# EAGLE schematic alltogether_8.2_4w (EAGLE 9.1.0), part 1 of 3

## Sheet 1 of 31: Power supply stage
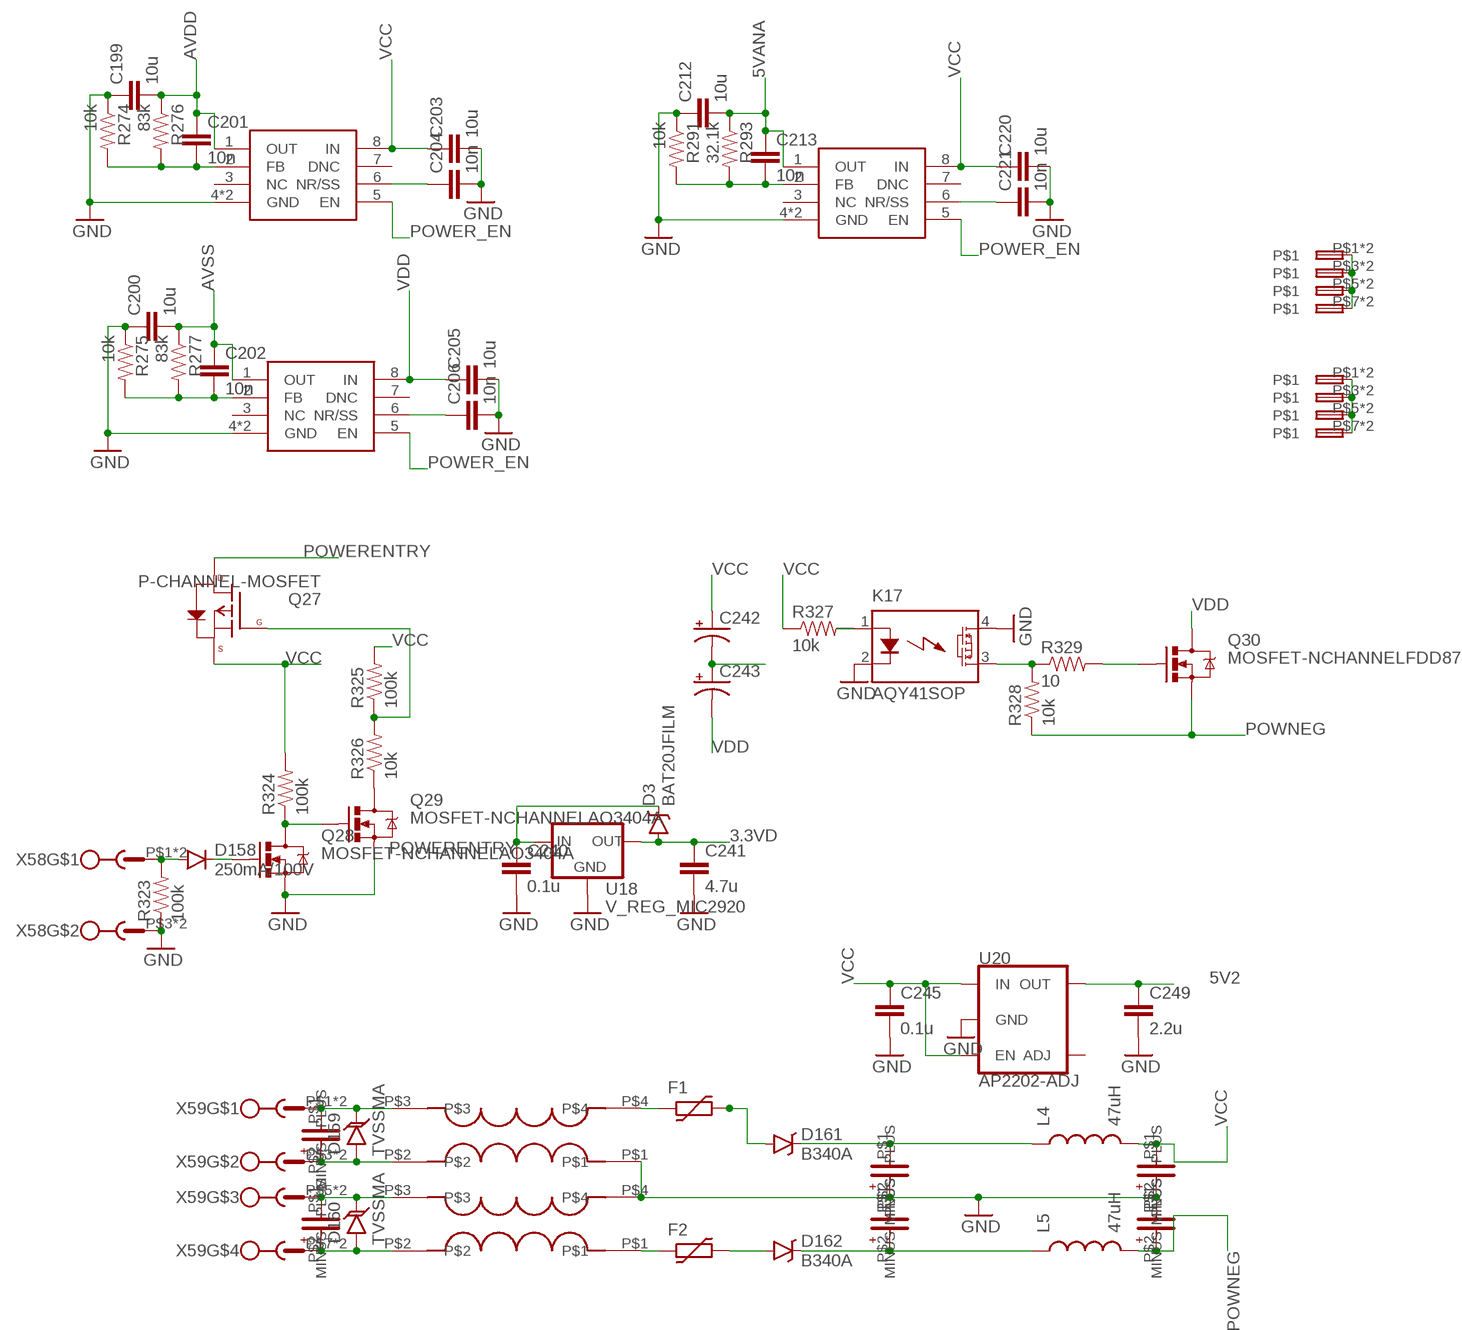
[diagram p0: schematic, sheet 1]

### Parts
C199  10u  CAP0805  [0805]
C200  10u  CAP0805  [0805]
C201  10n  CAP0402-CAP  [0402-CAP]
C202  10n  CAP0402-CAP  [0402-CAP]
C203  10u  CAP0805  [0805]
C204  10n  CAP0402-CAP  [0402-CAP]
C205  10u  CAP0805  [0805]
C206  10n  CAP0402-CAP  [0402-CAP]
C212  10u  CAP0805  [0805]
C213  10n  CAP0402-CAP  [0402-CAP]
C220  10u  CAP0805  [0805]
C221  10n  CAP0402-CAP  [0402-CAP]
C238  CAPACITOR  [LLL31]
C239  CAPACITOR  [LLL31]
C240  0.1u  CAP0402-CAP  [0402-CAP]
C241  4.7u  CAP0402-CAP  [0402-CAP]
C242  CAP_POLPTH4  [CPOL-RADIAL-1000UF-25V]
C243  CAP_POLPTH4  [CPOL-RADIAL-1000UF-25V]
C245  0.1u  CAP0402-CAP  [0402-CAP]
C246  1u  CAPACITOR  [LLL31]
C247  1u  CAPACITOR  [LLL31]
C249  2.2u  CAP0402-CAP  [0402-CAP]
C250  1u  CAPACITOR  [LLL31]
C251  1u  CAPACITOR  [LLL31]
D3  BAT20JFILM  [SOD-323]
D158  250mA/100V  DIODEBAS16  [SOD-323]
D159  TVSSMA  [SMA-DIODE]
D160  TVSSMA  [SMA-DIODE]
D161  B340A  DIODE-SCHOTTKY-B340A  [SMA-DIODE]
D162  B340A  DIODE-SCHOTTKY-B340A  [SMA-DIODE]
F1  FUSE_PTC-0805  [PTC0805]
F2  FUSE_PTC-0805  [PTC0805]
K17  AQY41SOP  [SOP04]
L2  COMMONMODEFILTER2014  [2014]
L3  COMMONMODEFILTER2014  [2014]
L4  47uH  INDUCTORCR54-47UH  [CR54]
L5  47uH  INDUCTORCR54-47UH  [CR54]
Q27  P-CHANNEL-MOSFET  [SOT23-3]
Q28  MOSFET-NCHANNELAO3404A  [SOT23-3]
Q29  MOSFET-NCHANNELAO3404A  [SOT23-3]
Q30  MOSFET-NCHANNELFDD8780  [DPAK]
R274  10k  RESISTOR0402-RES  [0402-RES]
R275  10k  RESISTOR0402-RES  [0402-RES]
R276  83k  RESISTOR0402-RES  [0402-RES]
R277  83k  RESISTOR0402-RES  [0402-RES]
R291  10k  RESISTOR0402-RES  [0402-RES]
R293  32.1k  RESISTOR0402-RES  [0402-RES]
R323  100k  RESISTOR0402-RES  [0402-RES]
R324  100k  RESISTOR0402-RES  [0402-RES]
R325  100k  RESISTOR0402-RES  [0402-RES]
R326  10k  RESISTOR0402-RES  [0402-RES]
R327  10k  RESISTOR0402-RES  [0402-RES]
R328  10k  RESISTOR0402-RES  [0402-RES]
R329  10  RESISTOR0402-RES  [0402-RES]
U7  TPS7A49  TPS7A30  [S-PDSO-G08]
U8  TPS7A30  [S-PDSO-G08]
U9  TPS7A49  TPS7A30  [S-PDSO-G08]
U18  V_REG_MIC2920  [SOT223]
U20  AP2202-ADJ  [SOT23-5]
X1  SPTAF1/4-3.5  [SPTAF1/4-3.5]
X2  SPTAF1/4-3.5  [SPTAF1/4-3.5]
X58  SPTA1.5/2  [SPTA1.5/2]
X59  SPTA1.5/4  [SPTA1.5/4]

### Nets
3.3VD: C241.1 D3.A U18.3(OUT) X2.P$1 X2.P$2 X2.P$3 X2.P$4 X2.P$5 X2.P$6 X2.P$7 X2.P$8 ; also sheet 2,3,4,5,6,11,12,13,15
5V2: C249.1 U20.5(OUT) ; also sheet 12
5VANA: C212.2 C213.1 R293.1 U9.1(OUT) ; also sheet 5
AVDD: C199.2 C201.1 R276.1 U7.1(OUT) ; also sheet 4,5,9,10
AVSS: C200.2 C202.1 R277.1 U8.1(OUT) ; also sheet 4,5,9,10
GND: C199.1 C200.1 C203.2 C204.2 C205.2 C206.2 C212.1 C220.2 C221.2 C240.2 C241.2 C242.- C243.+ C245.2 C246.P$2(PLUS) C247.P$1(MINUS) C249.2 C250.P$2(PLUS) C251.P$1(MINUS) K17.2(K) K17.4(DS1) L2.P$1 L3.P$4 Q28.2(S) Q29.2(S) R274.1 R275.1 R291.1 R323.1 U7.4(GND) U7.TH(GND) U8.4(GND) U8.TH(GND) U9.4(GND) U9.TH(GND) U18.2(GND) U20.2(GND) X1.P$1 X1.P$2 X1.P$3 X1.P$4 X1.P$5 X1.P$6 X1.P$7 X1.P$8 X58.P$3 X58.P$4 ; also sheet 2,3,4,5,6,7,8,9,10,11,12,13,15,16,17,18,19,20,21,22,23,24,25,26,27,28,29,30,31
N$28: Q28.3(D) Q29.1(G) R324.1
N$30: Q29.3(D) R326.1
N$31: Q27.1(G) R325.1 R326.2
N$34: D158.A R323.2 X58.P$1 X58.P$2
N$145: K17.3(DS2) R328.2 R329.1
N$148: Q30.1(G) R329.2
N$164: C239.P$1(MINUS) D160.C L3.P$3 X59.P$5 X59.P$6
N$183: C221.1 U9.6(NR/SS)
N$184: C213.2 R291.2 R293.2 U9.2(FB)
N$188: K17.1(A) R327.2
N$191: C238.P$1(MINUS) D159.C L2.P$3 X59.P$1 X59.P$2
N$194: C246.P$1(MINUS) D161.C L4.P$1
N$195: C238.P$2(PLUS) D159.A L2.P$2 X59.P$3 X59.P$4
N$197: C239.P$2(PLUS) D160.A L3.P$2 X59.P$7 X59.P$8
N$198: C247.P$2(PLUS) D162.C L5.P$1
N$199: F1.1 L2.P$4
N$200: F2.1 L3.P$1
N$226: C204.1 U7.6(NR/SS)
N$227: C201.2 R274.2 R276.2 U7.2(FB)
N$230: C206.1 U8.6(NR/SS)
N$231: C202.2 R275.2 R277.2 U8.2(FB)
N$241: D162.A F2.2
N$255: D161.A F1.2
POWER_EN: U7.5(EN) U8.5(EN) U9.5(EN) ; also sheet 2,3
POWERENTRY: C240.1 D3.C D158.C Q27.3(D) Q28.1(G) U18.1(IN)
POWNEG: C251.P$2(PLUS) L5.P$2 Q30.3(S) R328.1
VCC: C203.1 C220.1 C242.+ C245.1 C250.P$1(MINUS) L4.P$2 Q27.2(S) R324.2 R325.2 R327.1 U7.8(IN) U9.8(IN) U20.1(IN) U20.3(EN) ; also sheet 2,3,7,8,11,13,15,16,17,18,19,20,21,22,23,24,25,26,27,28,29,30,31
VDD: C205.1 C243.- Q30.4(D) U8.8(IN) ; also sheet 3,7,8,15,16,17,18,19,20,21,22,23,24,25,26,27,28,29,30,31
Unconnected: U7.3(NC) U7.7(DNC) U8.3(NC) U8.7(DNC) U9.3(NC) U9.7(DNC) U20.4(ADJ)

## Sheet 2 of 31: Master Digital
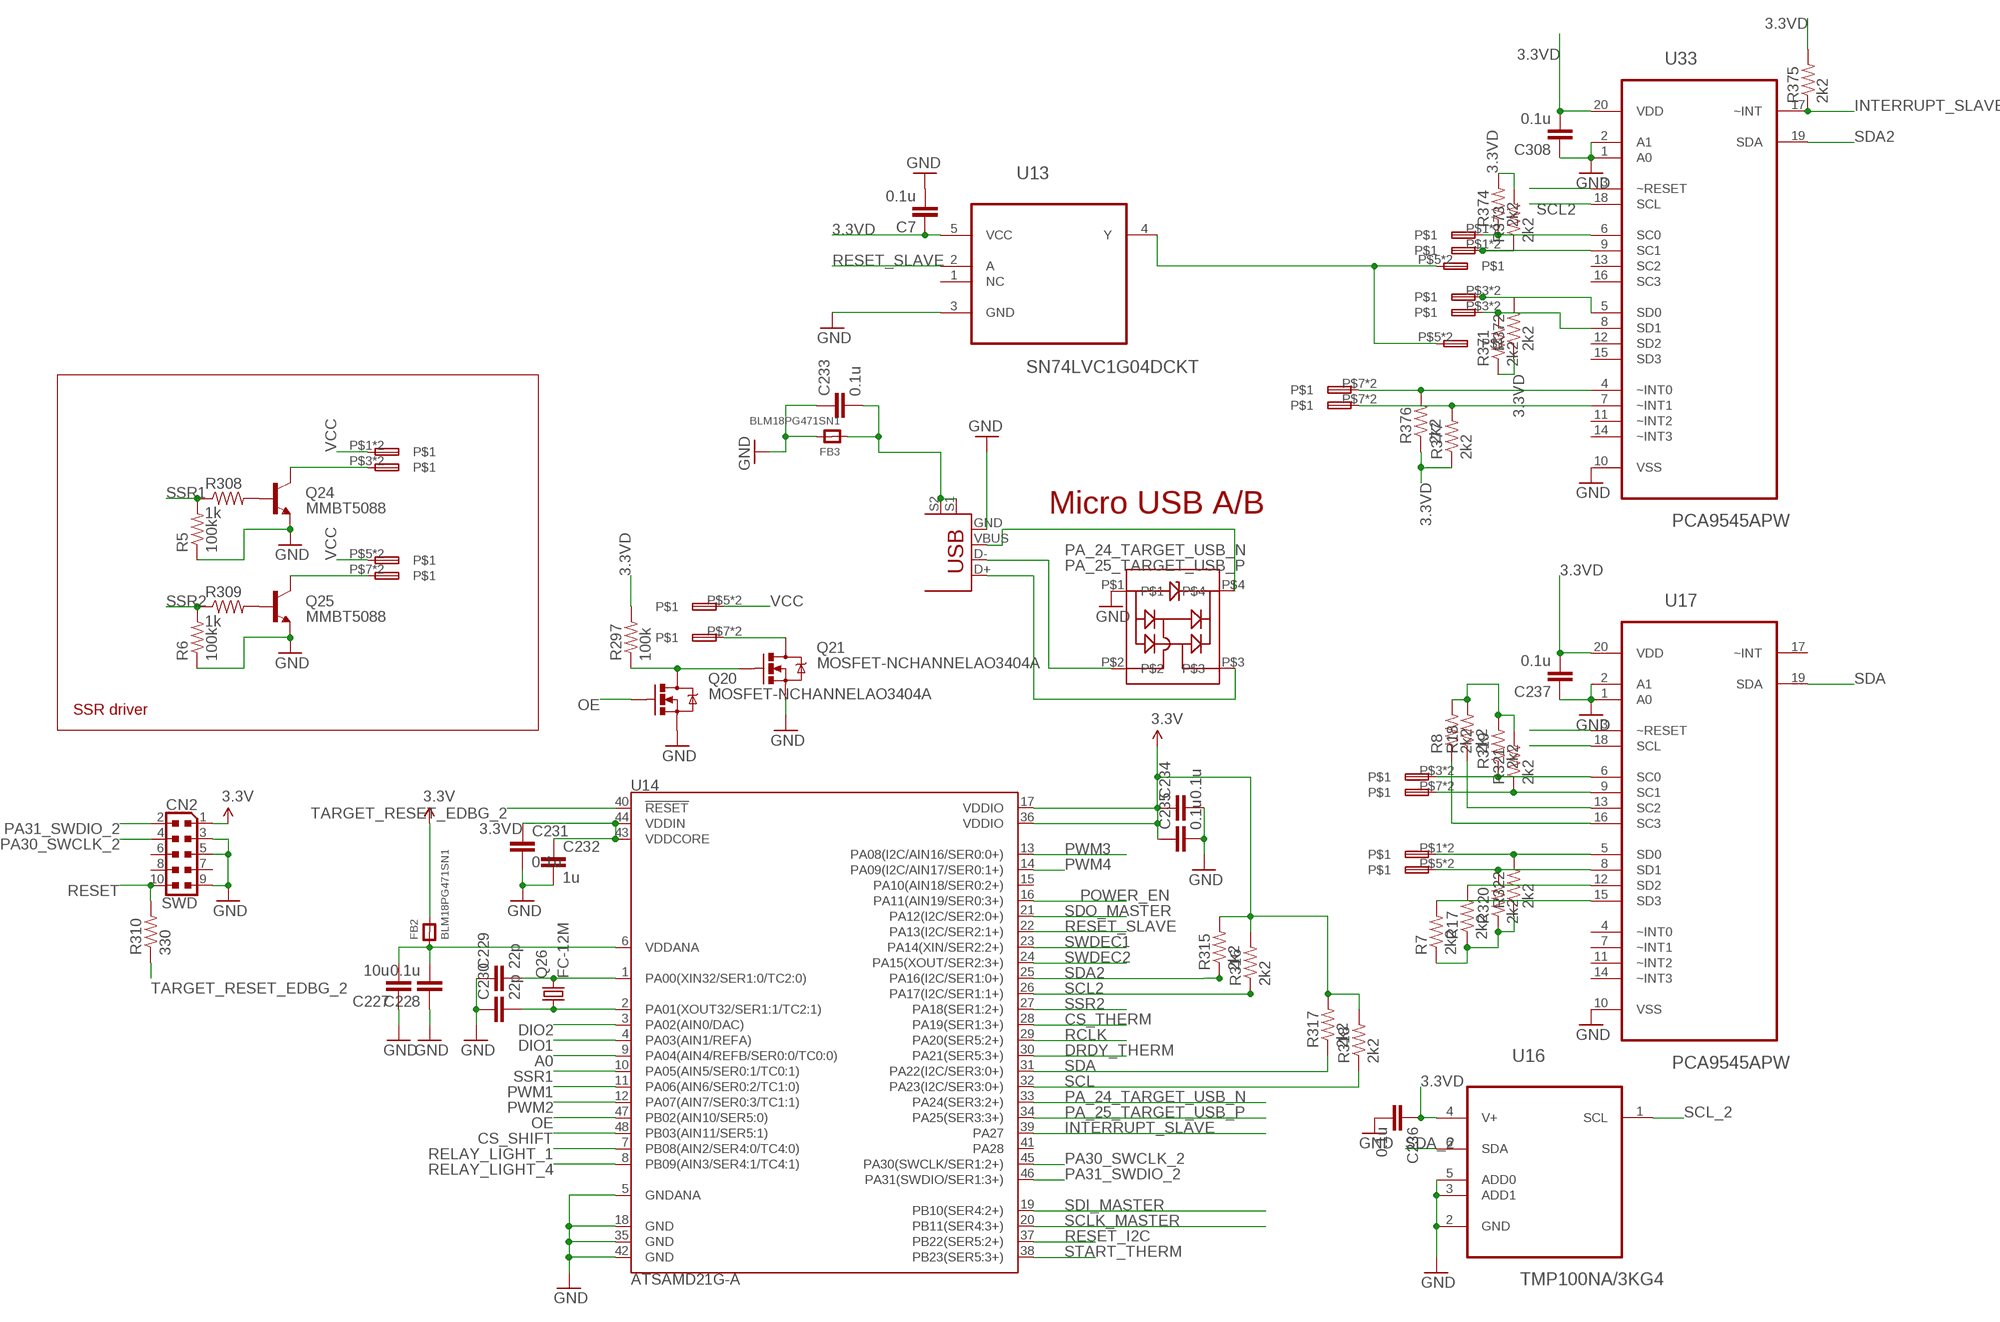
[diagram p1: schematic, sheet 2]

### Parts
C7  0.1u  CAP0402-CAP  [0402-CAP]
C227  10u  CAP0805  [0805]
C228  0.1u  CAP0402-CAP  [0402-CAP]
C229  22p  CAP0402-CAP  [0402-CAP]
C230  22p  CAP0402-CAP  [0402-CAP]
C231  0.1u  CAP0402-CAP  [0402-CAP]
C232  1u  CAP0402-CAP  [0402-CAP]
C233  0.1u  CAP0402-CAP  [0402-CAP]
C234  0.1u  CAP0402-CAP  [0402-CAP]
C235  0.1u  CAP0402-CAP  [0402-CAP]
C236  0.1u  CAP0402-CAP  [0402-CAP]
C237  0.1u  CAP0402-CAP  [0402-CAP]
C308  0.1u  CAP0402-CAP  [0402-CAP]
CN2  SWD  CONNETTORI_0171_PH127-205DF055G00A  [CONNETTORI_PINHEAD-2X5-P127]
FB2  BLM18PG471SN1  FERRITE_0603MP  [_0603MP]
FB3  BLM18PG471SN1  FERRITE_0603MP  [_0603MP]
Q20  MOSFET-NCHANNELAO3404A  [SOT23-3]
Q21  MOSFET-NCHANNELAO3404A  [SOT23-3]
Q24  MMBT5088  TRANSISTOR_NPNMMBT5088  [SOT23-3]
Q25  MMBT5088  TRANSISTOR_NPNMMBT5088  [SOT23-3]
Q26  FC-12M  [FC-12M]
R5  100k  RESISTOR0402-RES  [0402-RES]
R6  100k  RESISTOR0402-RES  [0402-RES]
R7  2k2  RESISTOR0402-RES  [0402-RES]
R8  2k2  RESISTOR0402-RES  [0402-RES]
R17  2k2  RESISTOR0402-RES  [0402-RES]
R18  2k2  RESISTOR0402-RES  [0402-RES]
R297  100k  RESISTOR0402-RES  [0402-RES]
R308  1k  RESISTOR0402-RES  [0402-RES]
R309  1k  RESISTOR0402-RES  [0402-RES]
R310  330  RESISTOR0402-RES  [0402-RES]
R315  2k2  RESISTOR0402-RES  [0402-RES]
R316  2k2  RESISTOR0402-RES  [0402-RES]
R317  2k2  RESISTOR0402-RES  [0402-RES]
R318  2k2  RESISTOR0402-RES  [0402-RES]
R319  2k2  RESISTOR0402-RES  [0402-RES]
R320  2k2  RESISTOR0402-RES  [0402-RES]
R321  2k2  RESISTOR0402-RES  [0402-RES]
R322  2k2  RESISTOR0402-RES  [0402-RES]
R371  2k2  RESISTOR0402-RES  [0402-RES]
R372  2k2  RESISTOR0402-RES  [0402-RES]
R373  2k2  RESISTOR0402-RES  [0402-RES]
R374  2k2  RESISTOR0402-RES  [0402-RES]
R375  2k2  RESISTOR0402-RES  [0402-RES]
R376  2k2  RESISTOR0402-RES  [0402-RES]
R377  2k2  RESISTOR0402-RES  [0402-RES]
U13  SN74LVC1G04DCKT  [SOT65P210X110-5N]
U14  ATSAMD21G-A  [TQFP-48]
U16  TMP100NA/3KG4  [SOT95P280X145-6N]
U17  PCA9545APW  [SOP65P640X110-20N]
U33  PCA9545APW  [SOP65P640X110-20N]
U$15  PRTR5V0U2X  [PRTR5V0U2X]
X54  SPTAF1/4-3.5  [SPTAF1/4-3.5]
X55  SPTAF1/4-3.5  [SPTAF1/4-3.5]
X56  USB+SHIELD  [USB-B-PTH]
X57  SPTAF1/4-3.5  [SPTAF1/4-3.5]
X77  SPTAF1/4-3.5  [SPTAF1/4-3.5]
X78  SPTAF1/4-3.5  [SPTAF1/4-3.5]

### Nets
3.3VD: C7.1 C231.1 C232.1 C234.1 C235.1 C236.1 C237.2 C308.2 CN2.1 FB2.2 R7.1 R8.2 R17.1 R18.2 R297.2 R315.2 R316.2 R317.2 R318.2 R319.2 R320.1 R321.2 R322.1 R371.1 R372.1 R373.2 R374.2 R375.2 R376.1 R377.1 U13.5(VCC) U14.17(VDDIO) U14.36(VDDIO) U14.43(VDDCORE) U14.44(VDDIN) U16.4(V+) U17.20(VDD) U33.20(VDD) ; supply symbol labelled 3.3V ; also sheet 1,3,4,5,6,11,12,13,15
A0: U14.9(PA04(AIN4/REFB/SER0:0/TC0:0)) ; also sheet 16,17,18,19,20,21,22,23,24,25,26,27,28,29,30,31
CS_SHIFT: U14.48(PB03(AIN11/SER5:1)) ; also sheet 6
CS_THERM: U14.28(PA19(SER1:3+)) ; also sheet 12
DIO1: U14.4(PA03(AIN1/REFA)) ; also sheet 6
DIO2: U14.3(PA02(AIN0/DAC)) ; also sheet 6
DRDY_THERM: U14.30(PA21(SER5:3+)) ; also sheet 12
GND: C7.2 C227.1 C228.1 C229.1 C230.1 C231.2 C232.2 C233.1 C234.2 C235.2 C236.2 C237.1 C308.1 CN2.3 CN2.5 CN2.9 FB3.2 Q20.2(S) Q21.2(S) Q24.2(E) Q25.2(E) R5.1 R6.1 U13.3(GND) U14.5(GNDANA) U14.18(GND) U14.35(GND) U14.42(GND) U16.2(GND) U16.3(ADD1) U16.5(ADD0) U17.1(A0) U17.2(A1) U17.10(VSS) U33.1(A0) U33.2(A1) U33.10(VSS) U$15.P$1 X56.GND ; also sheet 1,3,4,5,6,7,8,9,10,11,12,13,15,16,17,18,19,20,21,22,23,24,25,26,27,28,29,30,31
INTERRUPT_SLAVE: R375.1 U14.39(PA27) U33.17(~INT)
N$10: U13.4(Y) X77.P$5 X77.P$6 X78.P$5 X78.P$6
N$33: R374.1 U33.6(SC0) X77.P$1 X77.P$2
N$78: R373.1 U33.9(SC1) X78.P$1 X78.P$2
N$79: R372.2 U33.5(SD0) X77.P$3 X77.P$4
N$93: R371.2 U33.8(SD1) X78.P$3 X78.P$4
N$94: R377.2 U33.7(~INT1) X78.P$7 X78.P$8
N$95: R376.2 U33.4(~INT0) X77.P$7 X77.P$8
N$134: Q24.3(C) X55.P$3 X55.P$4
N$135: Q24.1(B) R308.2
N$136: Q25.1(B) R309.2
N$137: Q25.3(C) X55.P$7 X55.P$8
N$159: U$15.P$4 X56.VBUS
N$234: C229.2 Q26.2 U14.1(PA00(XIN32/SER1:0/TC2:0))
N$235: C230.2 Q26.1 U14.2(PA01(XOUT32/SER1:1/TC2:1))
N$236: C227.2 C228.2 FB2.1 U14.6(VDDANA)
N$257: Q21.3(D) X54.P$7 X54.P$8
N$313: Q20.3(D) Q21.1(G) R297.1
OE: Q20.1(G) U14.47(PB02(AIN10/SER5:0)) ; also sheet 6
PA30_SWCLK_2: CN2.4 U14.45(PA30(SWCLK/SER1:2+))
PA31_SWDIO_2: CN2.2 U14.46(PA31(SWDIO/SER1:3+))
PA_24_TARGET_USB_N: U14.33(PA24(SER3:2+)) U$15.P$2 X56.D-
PA_25_TARGET_USB_P: U14.34(PA25(SER3:3+)) U$15.P$3 X56.D+
POWER_EN: U14.16(PA11(AIN19/SER0:3+)) ; also sheet 1,3
PWM1: U14.11(PA06(AIN6/SER0:2/TC1:0)) ; also sheet 11
PWM2: U14.12(PA07(AIN7/SER0:3/TC1:1)) ; also sheet 11
PWM3: U14.13(PA08(I2C/AIN16/SER0:0+)) ; also sheet 11
PWM4: U14.14(PA09(I2C/AIN17/SER0:1+)) ; also sheet 11
RCLK: U14.29(PA20(SER5:2+)) ; also sheet 6
RELAY_LIGHT_1: U14.7(PB08(AIN2/SER4:0/TC4:0)) ; also sheet 11
RELAY_LIGHT_4: U14.8(PB09(AIN3/SER4:1/TC4:1)) ; also sheet 11
RESET: CN2.10 R310.2 ; also sheet 3,5,12
RESET_I2C: U14.37(PB22(SER5:2+)) U17.3(~RESET)
RESET_SLAVE: U13.2(A) U14.22(PA13(I2C/SER2:1+)) U33.3(~RESET)
SCL: R318.1 U14.32(PA23(I2C/SER3:0+)) U17.18(SCL) ; also sheet 3,15
SCL2: R316.1 U14.26(PA17(I2C/SER1:1+)) U33.18(SCL)
SCL_2: R18.1 U16.1(SCL) U17.13(SC2)
SCL_3: R8.1 U17.16(SC3) ; also sheet 6
SCL_LOCAL_0: R319.1 U17.6(SC0) X57.P$3 X57.P$4
SCL_LOCAL_1: R321.1 U17.9(SC1) X57.P$7 X57.P$8
SCLK_MASTER: U14.20(PB11(SER4:3+)) ; also sheet 6,12
SDA: R317.1 U14.31(PA22(I2C/SER3:0+)) U17.19(SDA) ; also sheet 3,15
SDA2: R315.1 U14.25(PA16(I2C/SER1:0+)) U33.19(SDA)
SDA_2: R17.2 U16.6(SDA) U17.12(SD2)
SDA_3: R7.2 U17.15(SD3) ; also sheet 6
SDI_MASTER: U14.19(PB10(SER4:2+)) ; also sheet 6,12
SDO_LOCAL_0: R322.2 U17.5(SD0) X57.P$1 X57.P$2
SDO_LOCAL_1: R320.2 U17.8(SD1) X57.P$5 X57.P$6
SDO_MASTER: U14.21(PA12(I2C/SER2:0+)) ; also sheet 12
SHIELD [gnd]: C233.2 FB3.1 X56.S1 X56.S2
SSR1: R5.2 R308.1 U14.10(PA05(AIN5/SER0:1/TC0:1)) ; also sheet 13
SSR2: R6.2 R309.1 U14.27(PA18(SER1:2+)) ; also sheet 13
START_THERM: U14.38(PB23(SER5:3+)) ; also sheet 12
SWDEC1: U14.23(PA14(XIN/SER2:2+)) ; also sheet 3
SWDEC2: U14.24(PA15(XOUT/SER2:3+)) ; also sheet 3
TARGET_RESET_EDBG_2: R310.1 U14.40(!RESET!)
VCC: X54.P$5 X54.P$6 X55.P$1 X55.P$2 X55.P$5 X55.P$6 ; also sheet 1,3,7,8,11,13,15,16,17,18,19,20,21,22,23,24,25,26,27,28,29,30,31
Unconnected: CN2.6 CN2.7 CN2.8 U13.1(NC) U14.15(PA10(AIN18/SER0:2+)) U14.41(PA28) U17.4(~INT0) U17.7(~INT1) U17.11(~INT2) U17.14(~INT3) U17.17(~INT) U33.11(~INT2) U33.12(SD2) U33.13(SC2) U33.14(~INT3) U33.15(SD3) U33.16(SC3)

### Notes on the sheet
- Micro USB A/B
- SSR driver

## Sheet 3 of 31: Slave digital
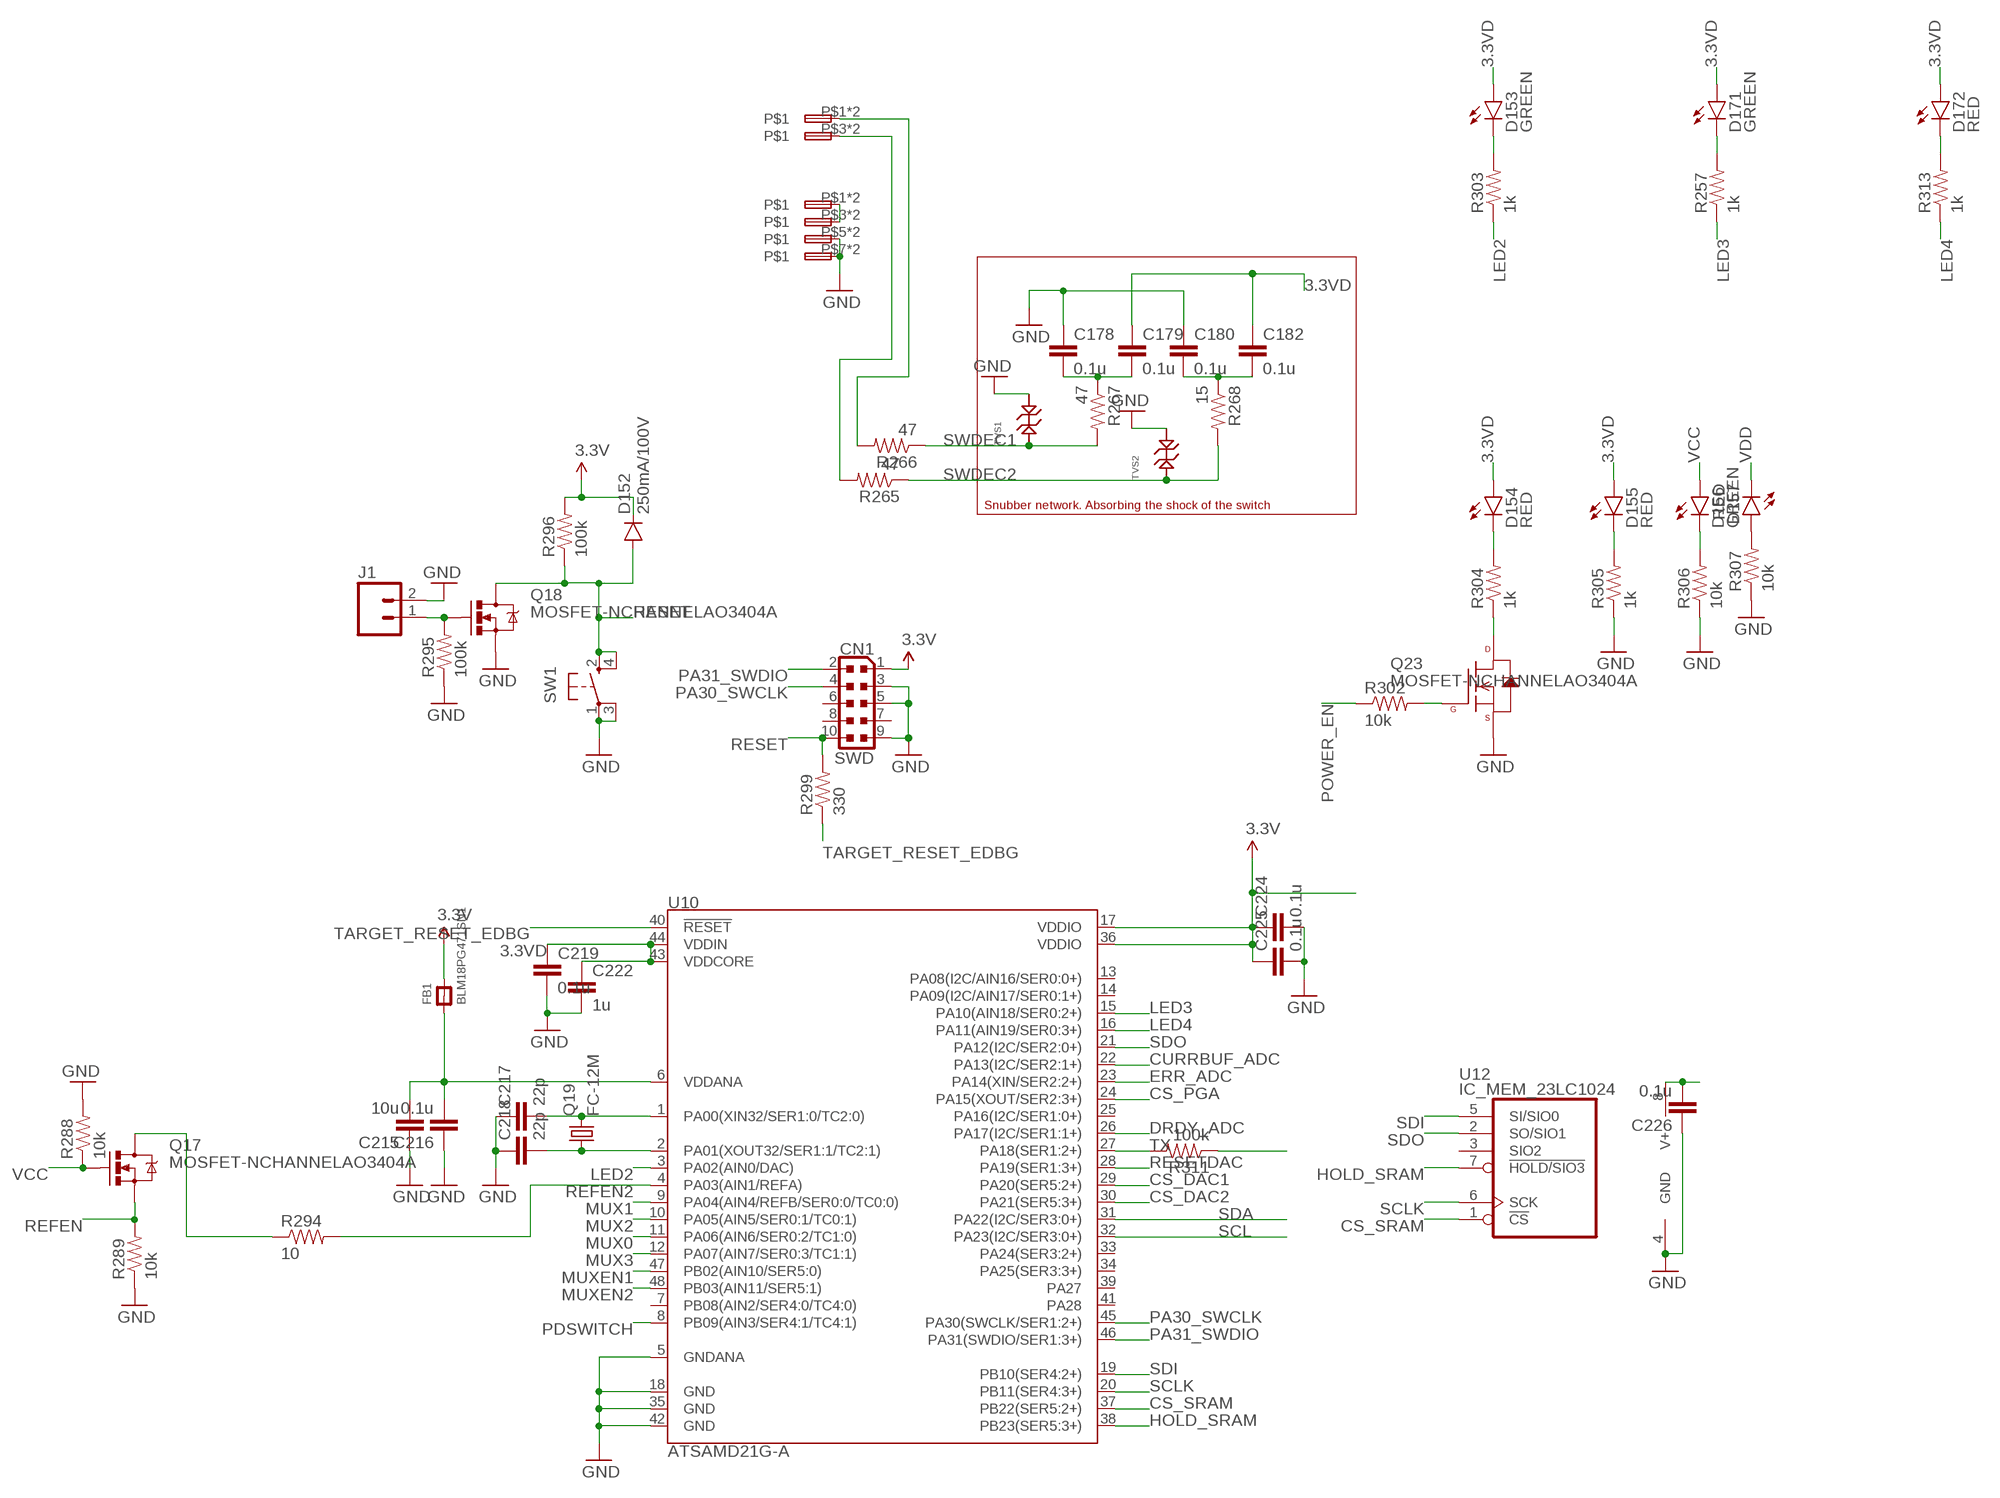
[diagram p2: schematic, sheet 3]

### Parts
C178  0.1u  CAP0402-CAP  [0402-CAP]
C179  0.1u  CAP0402-CAP  [0402-CAP]
C180  0.1u  CAP0402-CAP  [0402-CAP]
C182  0.1u  CAP0402-CAP  [0402-CAP]
C215  10u  CAP0805  [0805]
C216  0.1u  CAP0402-CAP  [0402-CAP]
C217  22p  CAP0402-CAP  [0402-CAP]
C218  22p  CAP0402-CAP  [0402-CAP]
C219  0.1u  CAP0402-CAP  [0402-CAP]
C222  1u  CAP0402-CAP  [0402-CAP]
C224  0.1u  CAP0402-CAP  [0402-CAP]
C225  0.1u  CAP0402-CAP  [0402-CAP]
C226  0.1u  CAP0402-CAP  [0402-CAP]
CN1  SWD  CONNETTORI_0171_PH127-205DF055G00A  [CONNETTORI_PINHEAD-2X5-P127]
D152  250mA/100V  DIODEBAS16  [SOD-323]
D153  GREEN  LED0603  [LED-0603]
D154  RED  LED0603  [LED-0603]
D155  RED  LED0603  [LED-0603]
D156  GREEN  LED0603  [LED-0603]
D157  RED  LED0603  [LED-0603]
D171  GREEN  LED0603  [LED-0603]
D172  RED  LED0603  [LED-0603]
FB1  BLM18PG471SN1  FERRITE_0603MP  [_0603MP]
J1  M02PTH  [1X02]
Q17  MOSFET-NCHANNELAO3404A  [SOT23-3]
Q18  MOSFET-NCHANNELAO3404A  [SOT23-3]
Q19  FC-12M  [FC-12M]
Q23  MOSFET-NCHANNELAO3404A  N-CHANNEL-MOSFET-BSS138  [SOT23-3]
R257  1k  RESISTOR0402-RES  [0402-RES]
R265  47  RESISTOR0402-RES  [0402-RES]
R266  47  RESISTOR0402-RES  [0402-RES]
R267  47  RESISTOR0402-RES  [0402-RES]
R268  15  RESISTOR0402-RES  [0402-RES]
R288  10k  RESISTOR0402-RES  [0402-RES]
R289  10k  RESISTOR0402-RES  [0402-RES]
R294  10  RESISTOR0402-RES  [0402-RES]
R295  100k  RESISTOR0402-RES  [0402-RES]
R296  100k  RESISTOR0402-RES  [0402-RES]
R299  330  RESISTOR0402-RES  [0402-RES]
R302  10k  RESISTOR0402-RES  [0402-RES]
R303  1k  RESISTOR0402-RES  [0402-RES]
R304  1k  RESISTOR0402-RES  [0402-RES]
R305  1k  RESISTOR0402-RES  [0402-RES]
R306  10k  RESISTOR0402-RES  [0402-RES]
R307  10k  RESISTOR0402-RES  [0402-RES]
R311  100k  RESISTOR0402-RES  [0402-RES]
R313  1k  RESISTOR0402-RES  [0402-RES]
SW1  SPST_TACT-KMR2  [KMR2]
TVS1  TVS_DIODE_SOD-323  [SOD-323]
TVS2  TVS_DIODE_SOD-323  [SOD-323]
U10  ATSAMD21G-A  [TQFP-48]
U12  IC_MEM_23LC1024  [SOIC-8]
X52  SPTAF1/2-3.5  [SPTAF1/2-3.5]
X53  SPTAF1/4-3.5  [SPTAF1/4-3.5]

### Nets
3.3VD: C179.1 C182.1 C219.1 C222.1 C224.1 C225.1 C226.2 CN1.1 D152.C D153.A D154.A D155.A D171.A D172.A FB1.2 R296.2 U10.17(VDDIO) U10.36(VDDIO) U10.43(VDDCORE) U10.44(VDDIN) U12.8(V+) X53.P$1 X53.P$2 X53.P$3 X53.P$4 ; supply symbol labelled 3.3V ; also sheet 1,2,4,5,6,11,12,13,15
CS_DAC1: U10.29(PA20(SER5:2+)) ; also sheet 9
CS_DAC2: U10.30(PA21(SER5:3+)) ; also sheet 10
CS_PGA: U10.24(PA15(XOUT/SER2:3+)) ; also sheet 5
CS_SRAM: U10.37(PB22(SER5:2+)) U12.1(!CS)
CURRBUF_ADC: U10.22(PA13(I2C/SER2:1+)) ; also sheet 5
DRDY_ADC: U10.26(PA17(I2C/SER1:1+)) ; also sheet 5
ERR_ADC: U10.23(PA14(XIN/SER2:2+)) ; also sheet 5
GND: C178.1 C180.1 C215.1 C216.1 C217.1 C218.1 C219.2 C222.2 C224.2 C225.2 C226.1 CN1.3 CN1.5 CN1.9 J1.2 Q18.2(S) Q23.2(S) R288.2 R289.1 R295.1 R305.1 R306.1 R307.1 SW1.1(P) SW1.3(P1) TVS1.CATH TVS2.CATH U10.5(GNDANA) U10.18(GND) U10.35(GND) U10.42(GND) U12.4(GND) X53.P$5 X53.P$6 X53.P$7 X53.P$8 ; also sheet 1,2,4,5,6,7,8,9,10,11,12,13,15,16,17,18,19,20,21,22,23,24,25,26,27,28,29,30,31
HOLD_SRAM: U10.38(PB23(SER5:3+)) U12.7(!HOLD/SIO3)
LED2: R303.1 U10.3(PA02(AIN0/DAC))
LED3: R257.1 U10.15(PA10(AIN18/SER0:2+))
LED4: R313.1 U10.16(PA11(AIN19/SER0:3+))
MOSFETDRIVE2: Q23.1(G) R302.2
MUX0: U10.11(PA06(AIN6/SER0:2/TC1:0)) ; also sheet 7,8
MUX1: U10.9(PA04(AIN4/REFB/SER0:0/TC0:0)) ; also sheet 7,8
MUX2: U10.10(PA05(AIN5/SER0:1/TC0:1)) ; also sheet 7,8
MUX3: U10.12(PA07(AIN7/SER0:3/TC1:1)) ; also sheet 7,8
MUXEN1: U10.47(PB02(AIN10/SER5:0)) ; also sheet 7
MUXEN2: U10.48(PB03(AIN11/SER5:1)) ; also sheet 8
N$96: D171.C R257.2
N$98: D172.C R313.2
N$149: C217.2 Q19.2 U10.1(PA00(XIN32/SER1:0/TC2:0))
N$150: C218.2 Q19.1 U10.2(PA01(XOUT32/SER1:1/TC2:1))
N$151: C215.2 C216.2 FB1.1 U10.6(VDDANA)
N$154: D155.C R305.2
N$155: D156.C R306.2
N$157: D154.C R304.2
N$158: Q23.3(D) R304.1
N$190: D157.A R307.2
N$225: J1.1 Q18.1(G) R295.2
N$228: D153.C R303.2
N$232: Q17.3(D) R294.1
N$250: C178.2 C179.2 R267.1
N$251: C180.2 C182.2 R268.1
PA30_SWCLK: CN1.4 U10.45(PA30(SWCLK/SER1:2+))
PA31_SWDIO: CN1.2 U10.46(PA31(SWDIO/SER1:3+))
PDSWITCH: U10.8(PB09(AIN3/SER4:1/TC4:1)) ; also sheet 4
POWER_EN: R302.1 ; also sheet 1,2
REFEN: Q17.2(S) R289.2 ; also sheet 9,10
REFEN2: R294.2 U10.4(PA03(AIN1/REFA))
RESET: CN1.10 D152.A Q18.3(D) R296.1 R299.2 SW1.2(S) SW1.4(S1) ; also sheet 2,5,12
RESETDAC: U10.28(PA19(SER1:3+)) ; also sheet 9,10
SCL: R311.1 U10.32(PA23(I2C/SER3:0+)) ; also sheet 2,15
SCLK: U10.20(PB11(SER4:3+)) U12.6(SCK) ; also sheet 5,9,10
SDA: U10.31(PA22(I2C/SER3:0+)) ; also sheet 2,15
SDI: U10.19(PB10(SER4:2+)) U12.5(SI/SIO0) ; also sheet 5,9,10
SDO: U10.21(PA12(I2C/SER2:0+)) U12.2(SO/SIO1) ; also sheet 5,9,10
SWDEC1: R266.1 R267.2 TVS1.ANODE ; also sheet 2
SWDEC1IN: R266.2 X52.P$1 X52.P$2
SWDEC2: R265.1 R268.2 TVS2.ANODE ; also sheet 2
SWDEC2IN: R265.2 X52.P$3 X52.P$4
TARGET_RESET_EDBG: R299.1 U10.40(!RESET!)
TX: R311.2 U10.27(PA18(SER1:2+))
VCC: D156.A Q17.1(G) R288.1 ; also sheet 1,2,7,8,11,13,15,16,17,18,19,20,21,22,23,24,25,26,27,28,29,30,31
VDD: D157.C ; also sheet 1,7,8,15,16,17,18,19,20,21,22,23,24,25,26,27,28,29,30,31
Unconnected: CN1.6 CN1.7 CN1.8 U10.7(PB08(AIN2/SER4:0/TC4:0)) U10.13(PA08(I2C/AIN16/SER0:0+)) U10.14(PA09(I2C/AIN17/SER0:1+)) U10.25(PA16(I2C/SER1:0+)) U10.33(PA24(SER3:2+)) U10.34(PA25(SER3:3+)) U10.39(PA27) U10.41(PA28) U12.3(SIO2)

### Notes on the sheet
- Snubber network. Absorbing the shock of the switch

## Sheet 4 of 31
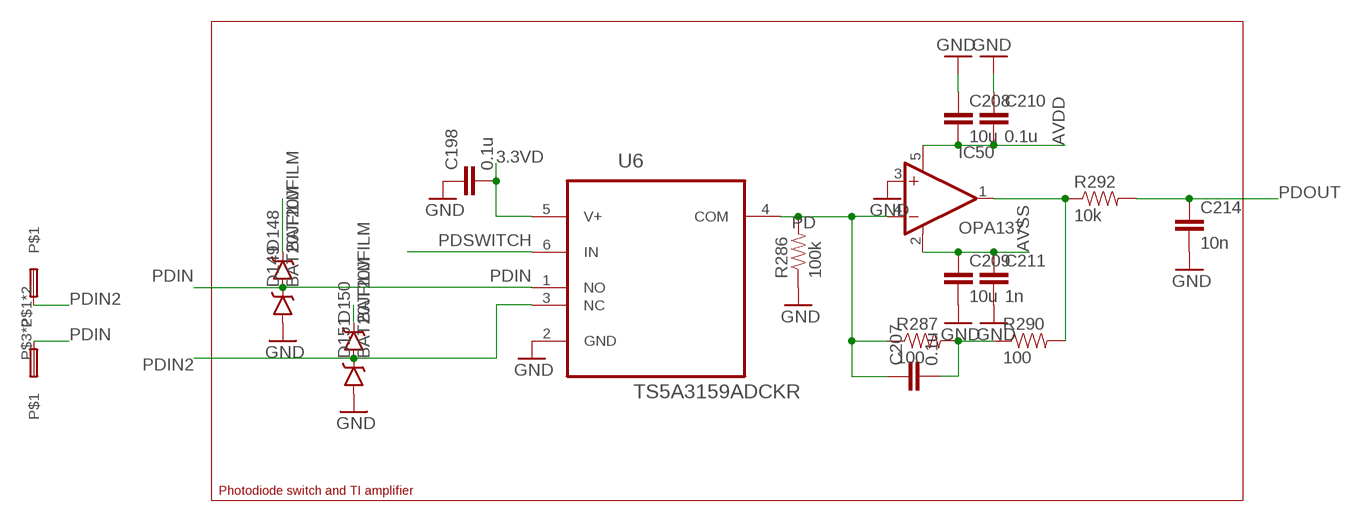
[diagram p3: schematic, sheet 4]

### Parts
C198  0.1u  CAP0402-CAP  [0402-CAP]
C207  0.1u  CAP0402-CAP  [0402-CAP]
C208  10u  CAP0805  [0805]
C209  10u  CAP0805  [0805]
C210  0.1u  CAP0402-CAP  [0402-CAP]
C211  1n  CAP0402-CAP  [0402-CAP]
C214  10n  CAP0402-CAP  [0402-CAP]
D148  BAT20JFILM  [SOD-323]
D149  BAT20JFILM  [SOD-323]
D150  BAT20JFILM  [SOD-323]
D151  BAT20JFILM  [SOD-323]
IC50  OPA137  OPA336N  [SOT23-5]
R286  100k  RESISTOR0402-RES  [0402-RES]
R287  100  RESISTOR0805-RES  [0805]
R290  100  RESISTOR0805-RES  [0805]
R292  10k  RESISTOR0402-RES  [0402-RES]
U6  TS5A3159ADCKR  [SOT65P210X110-6N]
X4  SPTAF1/2-3.5  [SPTAF1/2-3.5]

### Nets
3.3VD: C198.2 D148.C D150.C U6.5(V+) ; also sheet 1,2,3,5,6,11,12,13,15
AVDD: C208.2 C210.2 IC50.5(V+) ; also sheet 1,5,9,10
AVSS: C209.1 C211.1 IC50.2(V-) ; also sheet 1,5,9,10
GND: C198.1 C208.1 C209.2 C210.1 C211.2 C214.2 D149.A D151.A IC50.3(+IN) R286.1 U6.2(GND) ; also sheet 1,2,3,5,6,7,8,9,10,11,12,13,15,16,17,18,19,20,21,22,23,24,25,26,27,28,29,30,31
N$187: IC50.1(OUT) R290.2 R292.1
N$189: C207.2 R287.2 R290.1
PD: C207.1 IC50.4(-IN) R286.2 R287.1 U6.4(COM)
PDIN: D148.A D149.C U6.1(NO) X4.P$3 X4.P$4
PDIN2: D150.A D151.C U6.3(NC) X4.P$1 X4.P$2
PDOUT: C214.1 R292.2 ; also sheet 5
PDSWITCH: U6.6(IN) ; also sheet 3

### Notes on the sheet
- Photodiode switch and TI amplifier

## Sheet 5 of 31
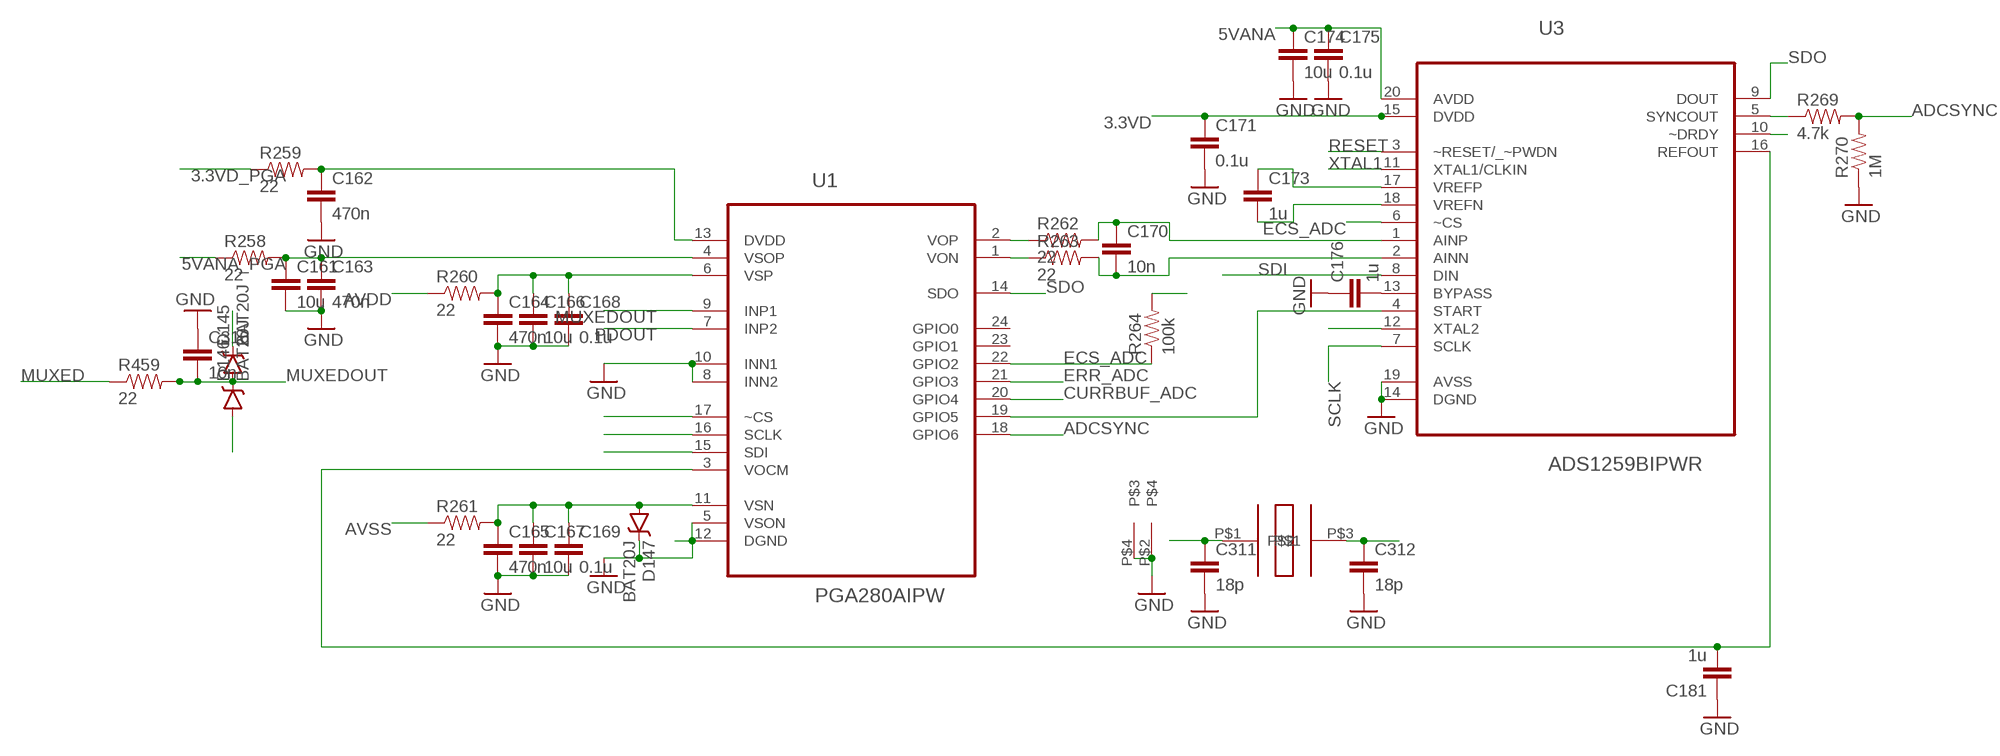
[diagram p4: schematic, sheet 5]

### Parts
C161  10u  CAP0805  [0805]
C162  470n  CAP0402-CAP  [0402-CAP]
C163  470n  CAP0402-CAP  [0402-CAP]
C164  470n  CAP0402-CAP  [0402-CAP]
C165  470n  CAP0402-CAP  [0402-CAP]
C166  10u  CAP0805  [0805]
C167  10u  CAP0805  [0805]
C168  0.1u  CAP0402-CAP  [0402-CAP]
C169  0.1u  CAP0402-CAP  [0402-CAP]
C170  10n  CAP0402-CAP  [0402-CAP]
C171  0.1u  CAP0402-CAP  [0402-CAP]
C173  1u  CAP0402-CAP  [0402-CAP]
C174  10u  CAP0805  [0805]
C175  0.1u  CAP0402-CAP  [0402-CAP]
C176  1u  CAP0402-CAP  [0402-CAP]
C181  1u  CAP0402-CAP  [0402-CAP]
C310  10n  CAP0402-CAP  [0402-CAP]
C311  18p  CAP0402-CAP  [0402-CAP]
C312  18p  CAP0402-CAP  [0402-CAP]
D145  BAT20J  DIODE-SCHOTTKY-BAT20J  [SOD-323]
D146  BAT20J  DIODE-SCHOTTKY-BAT20J  [SOD-323]
D147  BAT20J  DIODE-SCHOTTKY-BAT20J  [SOD-323]
R258  22  RESISTOR0402-RES  [0402-RES]
R259  22  RESISTOR0402-RES  [0402-RES]
R260  22  RESISTOR0402-RES  [0402-RES]
R261  22  RESISTOR0402-RES  [0402-RES]
R262  22  RESISTOR0402-RES  [0402-RES]
R263  22  RESISTOR0402-RES  [0402-RES]
R264  100k  RESISTOR0402-RES  [0402-RES]
R269  4.7k  RESISTOR0402-RES  [0402-RES]
R270  1M  RESISTOR0402-RES  [0402-RES]
R459  22  RESISTOR0402-RES  [0402-RES]
U1  PGA280AIPW  [SOP65P640X120-24N]
U3  ADS1259BIPWR  [SOP65P640X120-20N]
U$1  ABMM2  [ABMM2]

### Nets
3.3VD: C171.1 R259.1 R264.2 U3.15(DVDD) ; also sheet 1,2,3,4,6,11,12,13,15
3.3VD_PGA: C162.1 R259.2 U1.13(DVDD)
5VANA: C174.1 C175.1 R258.1 U3.20(AVDD) ; also sheet 1
5VANA_PGA: C161.1 C163.1 R258.2 U1.4(VSOP)
ADCSYNC: R269.2 R270.2 U1.18(GPIO6)
AVDD: D145.C R260.1 ; also sheet 1,4,9,10
AVSS: D146.A R261.1 ; also sheet 1,4,9,10
CS_PGA: U1.17(~CS) ; also sheet 3
CURRBUF_ADC: U1.20(GPIO4) ; also sheet 3
DRDY_ADC: U3.10(~DRDY) ; also sheet 3
ECS_ADC: R264.1 U1.22(GPIO2) U3.6(~CS)
ERR_ADC: U1.21(GPIO3) ; also sheet 3
GND: C161.2 C162.2 C163.2 C164.2 C165.2 C166.2 C167.2 C168.2 C169.2 C171.2 C174.2 C175.2 C176.1 C181.1 C310.1 C311.2 C312.2 D147.C R270.1 U1.5(VSON) U1.8(INN2) U1.10(INN1) U1.12(DGND) U3.14(DGND) U3.19(AVSS) U$1.P$2 U$1.P$4 ; also sheet 1,2,3,4,6,7,8,9,10,11,12,13,15,16,17,18,19,20,21,22,23,24,25,26,27,28,29,30,31
MUXED: R459.1 ; also sheet 7,8
MUXEDOUT: C310.2 D145.A D146.C R459.2 U1.9(INP1)
N$266: R262.1 U1.2(VOP)
N$293: R263.1 U1.1(VON)
N$294: C170.1 R262.2 U3.1(AINP)
N$295: C170.2 R263.2 U3.2(AINN)
N$297: C181.2 U1.3(VOCM) U3.16(REFOUT)
N$299: R269.1 U3.5(SYNCOUT)
N$306: U1.19(GPIO5) U3.4(START)
N$307: C164.1 C166.1 C168.1 R260.2 U1.6(VSP)
N$308: C176.2 U3.13(BYPASS)
N$309: C165.1 C167.1 C169.1 D147.A R261.2 U1.11(VSN)
N$315: C173.1 U3.17(VREFP)
N$316: C173.2 U3.18(VREFN)
PDOUT: U1.7(INP2) ; also sheet 4
RESET: U3.3(~RESET/_~PWDN) ; also sheet 2,3,12
SCLK: U1.16(SCLK) U3.7(SCLK) ; also sheet 3,9,10
SDI: U1.15(SDI) U3.8(DIN) ; also sheet 3,9,10
SDO: U1.14(SDO) U3.9(DOUT) ; also sheet 3,9,10
XTAL1: C311.1 U3.11(XTAL1/CLKIN) U$1.P$1
XTAL2: C312.1 U3.12(XTAL2) U$1.P$3
Unconnected: U1.23(GPIO1) U1.24(GPIO0)

## Sheet 6 of 31: Relay drivers
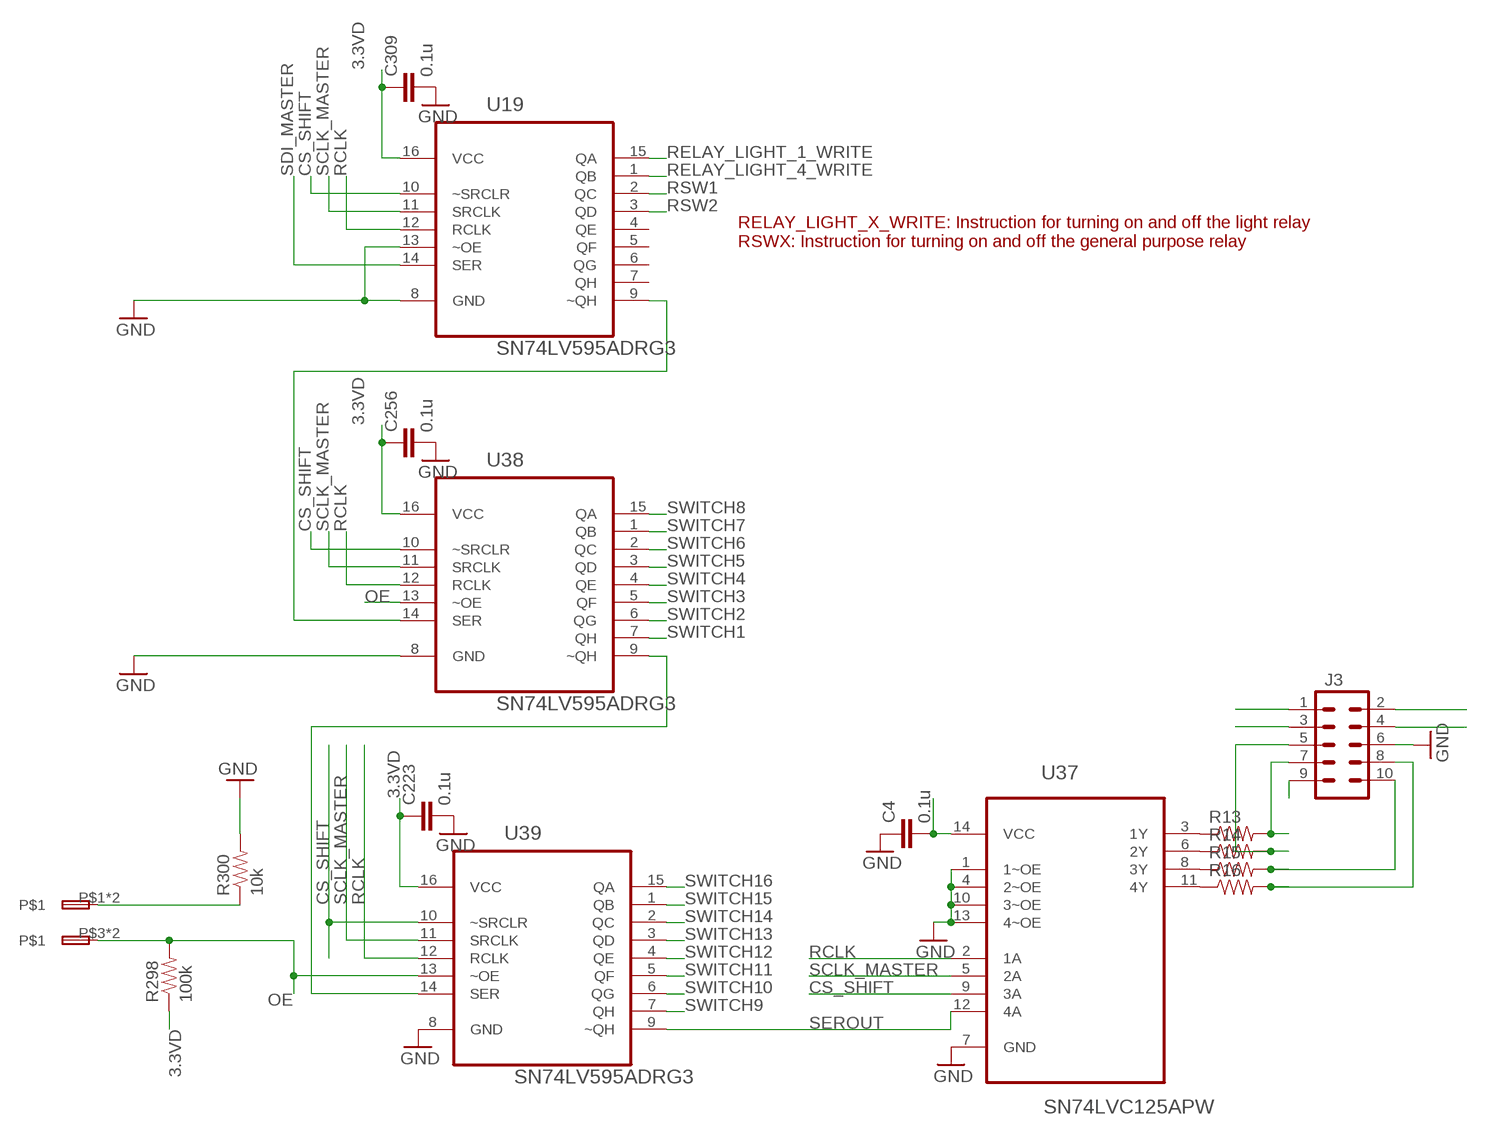
[diagram p5: schematic, sheet 6]

### Parts
C4  0.1u  CAP0402-CAP  [0402-CAP]
C223  0.1u  CAP0402-CAP  [0402-CAP]
C256  0.1u  CAP0402-CAP  [0402-CAP]
C309  0.1u  CAP0402-CAP  [0402-CAP]
J3  M05X2SHD  [2X5-SHROUDED]
R13  RESISTOR0402  [0402-RES]
R14  RESISTOR0402  [0402-RES]
R15  RESISTOR0402  [0402-RES]
R16  RESISTOR0402  [0402-RES]
R298  100k  RESISTOR0402-RES  [0402-RES]
R300  10k  RESISTOR0402-RES  [0402-RES]
U19  SN74LV595ADRG3  [SOIC127P600X175-16N]
U37  SN74LVC125APW  [SOP65P640X120-14N]
U38  SN74LV595ADRG3  [SOIC127P600X175-16N]
U39  SN74LV595ADRG3  [SOIC127P600X175-16N]

### Nets
3.3VD: C4.2 C223.1 C256.1 C309.1 J3.9 R298.1 U19.16(VCC) U37.14(VCC) U38.16(VCC) U39.16(VCC) ; also sheet 1,2,3,4,5,11,12,13,15
CS_SHIFT: U19.10(~SRCLR) U37.9(3A) U38.10(~SRCLR) U39.10(~SRCLR) ; also sheet 2
CS_SHIFT_BUFFERED: J3.10 R15.2
DIO1: J3.1 ; also sheet 2
DIO2: J3.2 ; also sheet 2
GND: C4.1 C223.2 C256.2 C309.2 J3.6 R300.2 U19.8(GND) U19.13(~OE) U37.1(1~OE) U37.4(2~OE) U37.7(GND) U37.10(3~OE) U37.13(4~OE) U38.8(GND) U39.8(GND) ; also sheet 1,2,3,4,5,7,8,9,10,11,12,13,15,16,17,18,19,20,21,22,23,24,25,26,27,28,29,30,31
N$6: R16.1 U37.11(4Y)
N$7: R15.1 U37.8(3Y)
N$8: R14.1 U37.6(2Y)
N$9: R13.1 U37.3(1Y)
N$233: R300.1 X54.P$1 X54.P$2
OE: R298.2 U38.13(~OE) U39.13(~OE) X54.P$3 X54.P$4 ; also sheet 2
RCLK: U19.12(RCLK) U37.2(1A) U38.12(RCLK) U39.12(RCLK) ; also sheet 2
RCLK_BUFFERED: J3.7 R13.2
RELAY_LIGHT_1_WRITE: U19.15(QA) ; also sheet 11
RELAY_LIGHT_4_WRITE: U19.1(QB) ; also sheet 11
RSW1: U19.2(QC) ; also sheet 13
RSW2: U19.3(QD) ; also sheet 13
SCL_3: J3.4 ; also sheet 2
SCLK_MASTER: U19.11(SRCLK) U37.5(2A) U38.11(SRCLK) U39.11(SRCLK) ; also sheet 2,12
SCLK_MASTER_BUFFERED: J3.5 R14.2
SDA_3: J3.3 ; also sheet 2
SDI_MASTER: U19.14(SER) ; also sheet 2,12
SEROUT: U37.12(4A) U39.9(~QH)
SEROUT_BUFFERED: J3.8 R16.2
SHIFT_SERIN: U38.9(~QH) U39.14(SER)
SHIFT_SERIN1: U19.9(~QH) U38.14(SER)
SWITCH1: U38.7(QH) ; also sheet 16
SWITCH2: U38.6(QG) ; also sheet 17
SWITCH3: U38.5(QF) ; also sheet 18
SWITCH4: U38.4(QE) ; also sheet 19
SWITCH5: U38.3(QD) ; also sheet 20
SWITCH6: U38.2(QC) ; also sheet 21
SWITCH7: U38.1(QB) ; also sheet 22
SWITCH8: U38.15(QA) ; also sheet 23
SWITCH9: U39.7(QH) ; also sheet 24
SWITCH10: U39.6(QG) ; also sheet 25
SWITCH11: U39.5(QF) ; also sheet 26
SWITCH12: U39.4(QE) ; also sheet 27
SWITCH13: U39.3(QD) ; also sheet 28
SWITCH14: U39.2(QC) ; also sheet 29
SWITCH15: U39.1(QB) ; also sheet 30
SWITCH16: U39.15(QA) ; also sheet 31
Unconnected: U19.4(QE) U19.5(QF) U19.6(QG) U19.7(QH)

### Notes on the sheet
- RELAY_LIGHT_X_WRITE: Instruction for turning on and off the light relay
  RSWX: Instruction for turning on and off the general purpose relay

## Sheet 7 of 31: MUX 2
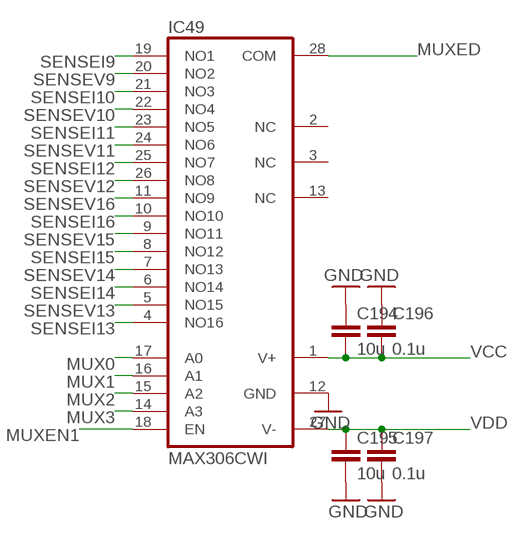
[diagram p6: schematic, sheet 7]

### Parts
C194  10u  CAP0805  [0805]
C195  10u  CAP0805  [0805]
C196  0.1u  CAP0402-CAP  [0402-CAP]
C197  0.1u  CAP0402-CAP  [0402-CAP]
IC49  MAX306CWI  [SO28L]

### Nets
GND: C194.1 C195.2 C196.1 C197.2 IC49.12(GND) ; also sheet 1,2,3,4,5,6,8,9,10,11,12,13,15,16,17,18,19,20,21,22,23,24,25,26,27,28,29,30,31
MUX0: IC49.17(A0) ; also sheet 3,8
MUX1: IC49.16(A1) ; also sheet 3,8
MUX2: IC49.15(A2) ; also sheet 3,8
MUX3: IC49.14(A3) ; also sheet 3,8
MUXED: IC49.28(COM) ; also sheet 5,8
MUXEN1: IC49.18(EN) ; also sheet 3
SENSEI9: IC49.19(NO1) ; also sheet 24
SENSEI10: IC49.21(NO3) ; also sheet 25
SENSEI11: IC49.23(NO5) ; also sheet 26
SENSEI12: IC49.25(NO7) ; also sheet 27
SENSEI13: IC49.4(NO16) ; also sheet 28
SENSEI14: IC49.6(NO14) ; also sheet 29
SENSEI15: IC49.8(NO12) ; also sheet 30
SENSEI16: IC49.10(NO10) ; also sheet 31
SENSEV9: IC49.20(NO2) ; also sheet 24
SENSEV10: IC49.22(NO4) ; also sheet 25
SENSEV11: IC49.24(NO6) ; also sheet 26
SENSEV12: IC49.26(NO8) ; also sheet 27
SENSEV13: IC49.5(NO15) ; also sheet 28
SENSEV14: IC49.7(NO13) ; also sheet 29
SENSEV15: IC49.9(NO11) ; also sheet 30
SENSEV16: IC49.11(NO9) ; also sheet 31
VCC: C194.2 C196.2 IC49.1(V+) ; also sheet 1,2,3,8,11,13,15,16,17,18,19,20,21,22,23,24,25,26,27,28,29,30,31
VDD: C195.1 C197.1 IC49.27(V-) ; also sheet 1,3,8,15,16,17,18,19,20,21,22,23,24,25,26,27,28,29,30,31
Unconnected: IC49.2(NC) IC49.3(NC) IC49.13(NC)

## Sheet 8 of 31: MUX 1
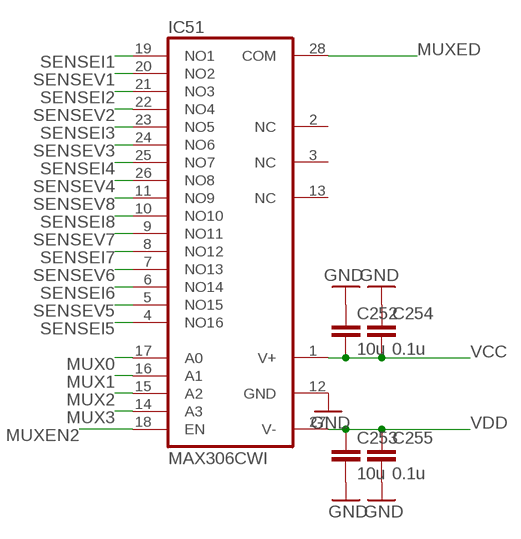
[diagram p7: schematic, sheet 8]

### Parts
C252  10u  CAP0805  [0805]
C253  10u  CAP0805  [0805]
C254  0.1u  CAP0402-CAP  [0402-CAP]
C255  0.1u  CAP0402-CAP  [0402-CAP]
IC51  MAX306CWI  [SO28L]

### Nets
GND: C252.1 C253.2 C254.1 C255.2 IC51.12(GND) ; also sheet 1,2,3,4,5,6,7,9,10,11,12,13,15,16,17,18,19,20,21,22,23,24,25,26,27,28,29,30,31
MUX0: IC51.17(A0) ; also sheet 3,7
MUX1: IC51.16(A1) ; also sheet 3,7
MUX2: IC51.15(A2) ; also sheet 3,7
MUX3: IC51.14(A3) ; also sheet 3,7
MUXED: IC51.28(COM) ; also sheet 5,7
MUXEN2: IC51.18(EN) ; also sheet 3
SENSEI1: IC51.19(NO1) ; also sheet 16
SENSEI2: IC51.21(NO3) ; also sheet 17
SENSEI3: IC51.23(NO5) ; also sheet 18
SENSEI4: IC51.25(NO7) ; also sheet 19
SENSEI5: IC51.4(NO16) ; also sheet 20
SENSEI6: IC51.6(NO14) ; also sheet 21
SENSEI7: IC51.8(NO12) ; also sheet 22
SENSEI8: IC51.10(NO10) ; also sheet 23
SENSEV1: IC51.20(NO2) ; also sheet 16
SENSEV2: IC51.22(NO4) ; also sheet 17
SENSEV3: IC51.24(NO6) ; also sheet 18
SENSEV4: IC51.26(NO8) ; also sheet 19
SENSEV5: IC51.5(NO15) ; also sheet 20
SENSEV6: IC51.7(NO13) ; also sheet 21
SENSEV7: IC51.9(NO11) ; also sheet 22
SENSEV8: IC51.11(NO9) ; also sheet 23
VCC: C252.2 C254.2 IC51.1(V+) ; also sheet 1,2,3,7,11,13,15,16,17,18,19,20,21,22,23,24,25,26,27,28,29,30,31
VDD: C253.1 C255.1 IC51.27(V-) ; also sheet 1,3,7,15,16,17,18,19,20,21,22,23,24,25,26,27,28,29,30,31
Unconnected: IC51.2(NC) IC51.3(NC) IC51.13(NC)

## Sheet 9 of 31: DAC 2
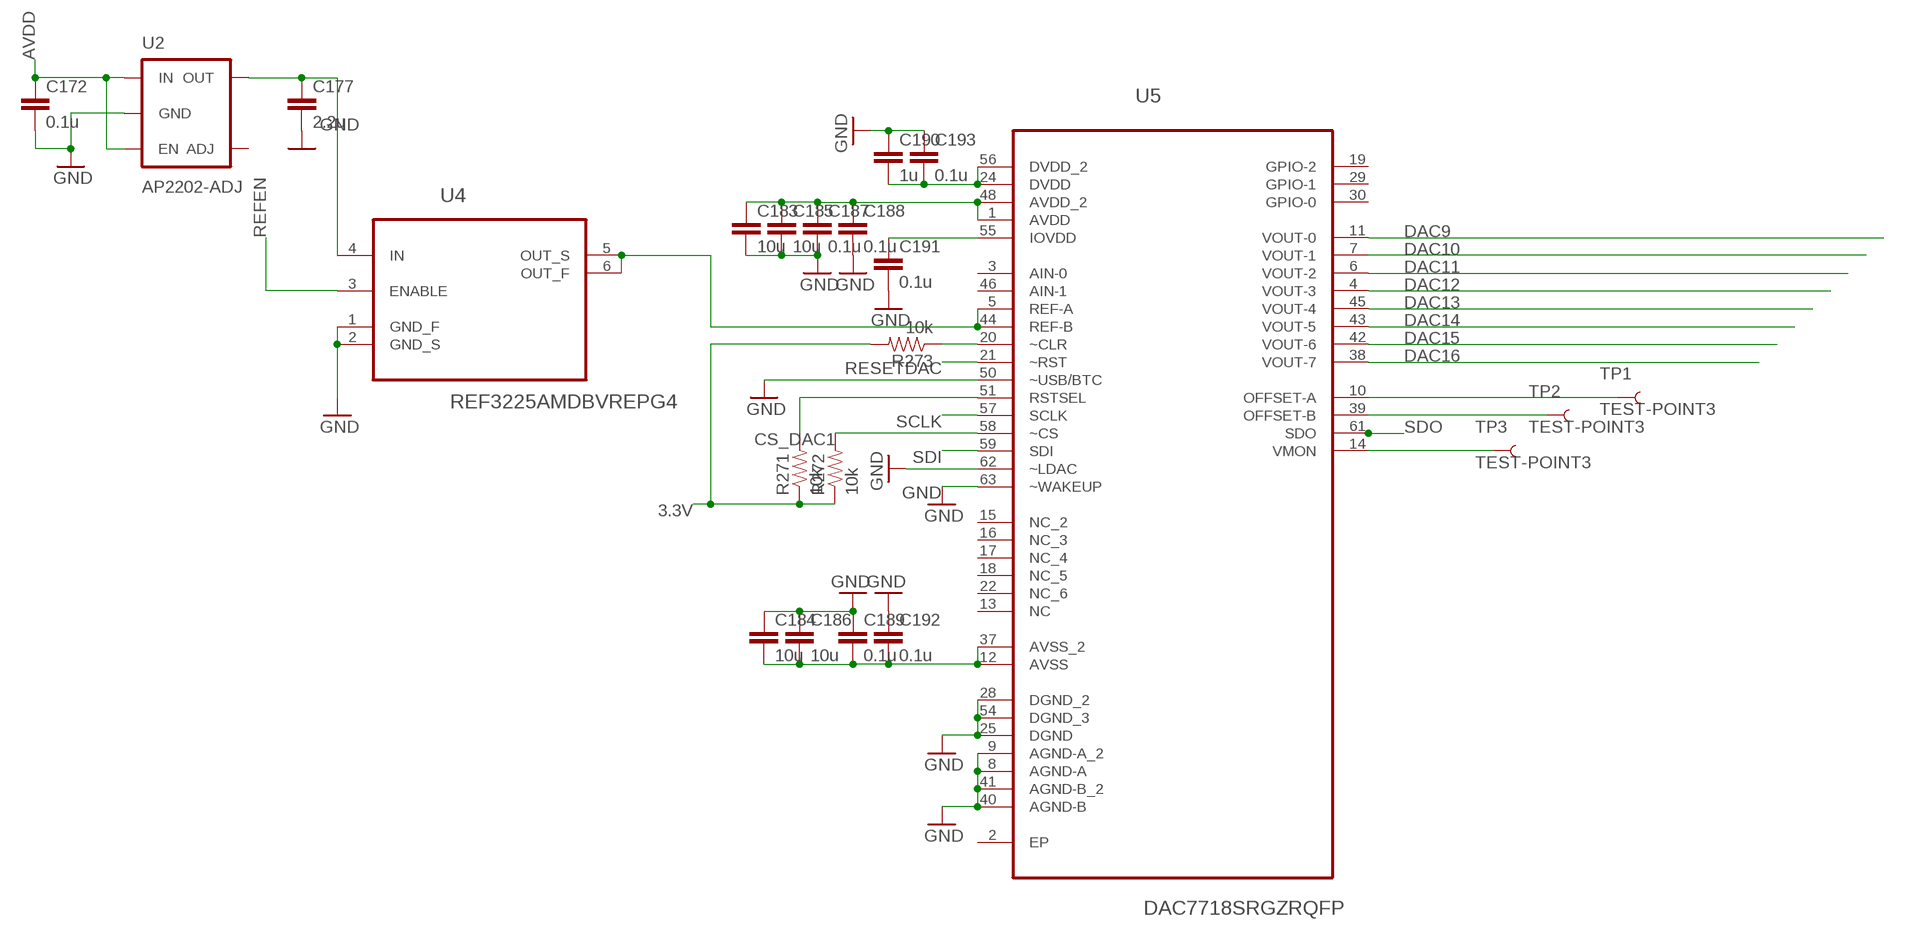
[diagram p8: schematic, sheet 9]

### Parts
C172  0.1u  CAP0402-CAP  [0402-CAP]
C177  2.2u  CAP0402-CAP  [0402-CAP]
C183  10u  CAP0805  [0805]
C184  10u  CAP0805  [0805]
C185  10u  CAP0805  [0805]
C186  10u  CAP0805  [0805]
C187  0.1u  CAP0402-CAP  [0402-CAP]
C188  0.1u  CAP0402-CAP  [0402-CAP]
C189  0.1u  CAP0402-CAP  [0402-CAP]
C190  1u  CAP0402-CAP  [0402-CAP]
C191  0.1u  CAP0402-CAP  [0402-CAP]
C192  0.1u  CAP0402-CAP  [0402-CAP]
C193  0.1u  CAP0402-CAP  [0402-CAP]
R271  10k  RESISTOR0402-RES  [0402-RES]
R272  10k  RESISTOR0402-RES  [0402-RES]
R273  10k  RESISTOR0402-RES  [0402-RES]
TP1  TEST-POINT3  [PAD.03X.03]
TP2  TEST-POINT3  [PAD.03X.03]
TP3  TEST-POINT3  [PAD.03X.03]
U2  AP2202-ADJ  [SOT23-5]
U4  REF3225AMDBVREPG4  [SOT95P280X145-6N]
U5  DAC7718SRGZRQFP  [QFP50P1200X1200X160-64N]

### Nets
3.3V: C177.1 C190.2 C191.1 C193.2 R271.1 R272.1 R273.2 U2.5(OUT) U4.4(IN) U5.24(DVDD) U5.55(IOVDD) U5.56(DVDD_2) ; also sheet 15
AVDD: C172.1 C183.1 C185.1 C187.1 C188.1 U2.1(IN) U2.3(EN) U5.1(AVDD) U5.48(AVDD_2) ; also sheet 1,4,5,10
AVSS: C184.2 C186.2 C189.2 C192.2 U5.12(AVSS) U5.37(AVSS_2) ; also sheet 1,4,5,10
CS_DAC1: R272.2 U5.58(~CS) ; also sheet 3
DAC9: U5.11(VOUT-0) ; also sheet 24
DAC10: U5.7(VOUT-1) ; also sheet 25
DAC11: U5.6(VOUT-2) ; also sheet 26
DAC12: U5.4(VOUT-3) ; also sheet 27
DAC13: U5.45(VOUT-4) ; also sheet 28
DAC14: U5.43(VOUT-5) ; also sheet 29
DAC15: U5.42(VOUT-6) ; also sheet 30
DAC16: U5.38(VOUT-7) ; also sheet 31
GND: C172.2 C177.2 C183.2 C184.1 C185.2 C186.1 C187.2 C188.2 C189.1 C190.1 C191.2 C192.1 C193.1 U2.2(GND) U4.1(GND_F) U4.2(GND_S) U5.8(AGND-A) U5.9(AGND-A_2) U5.25(DGND) U5.28(DGND_2) U5.40(AGND-B) U5.41(AGND-B_2) U5.50(~USB/BTC) U5.54(DGND_3) U5.62(~LDAC) U5.63(~WAKEUP) ; also sheet 1,2,3,4,5,6,7,8,10,11,12,13,15,16,17,18,19,20,21,22,23,24,25,26,27,28,29,30,31
N$165: TP1.P$1 U5.10(OFFSET-A)
N$166: R271.2 U5.51(RSTSEL)
N$167: R273.1 U5.20(~CLR)
N$168: TP2.P$1 U5.39(OFFSET-B)
N$169: TP3.P$1 U5.14(VMON)
N$170: U4.5(OUT_S) U4.6(OUT_F) U5.5(REF-A) U5.44(REF-B)
REFEN: U4.3(ENABLE) ; also sheet 3,10
RESETDAC: U5.21(~RST) ; also sheet 3,10
SCLK: U5.57(SCLK) ; also sheet 3,5,10
SDI: U5.59(SDI) ; also sheet 3,5,10
SDO: U5.61(SDO) ; also sheet 3,5,10
Unconnected: U2.4(ADJ) U5.2(EP) U5.3(AIN-0) U5.13(NC) U5.15(NC_2) U5.16(NC_3) U5.17(NC_4) U5.18(NC_5) U5.19(GPIO-2) U5.22(NC_6) U5.29(GPIO-1) U5.30(GPIO-0) U5.46(AIN-1)

## Sheet 10 of 31: DAC 1
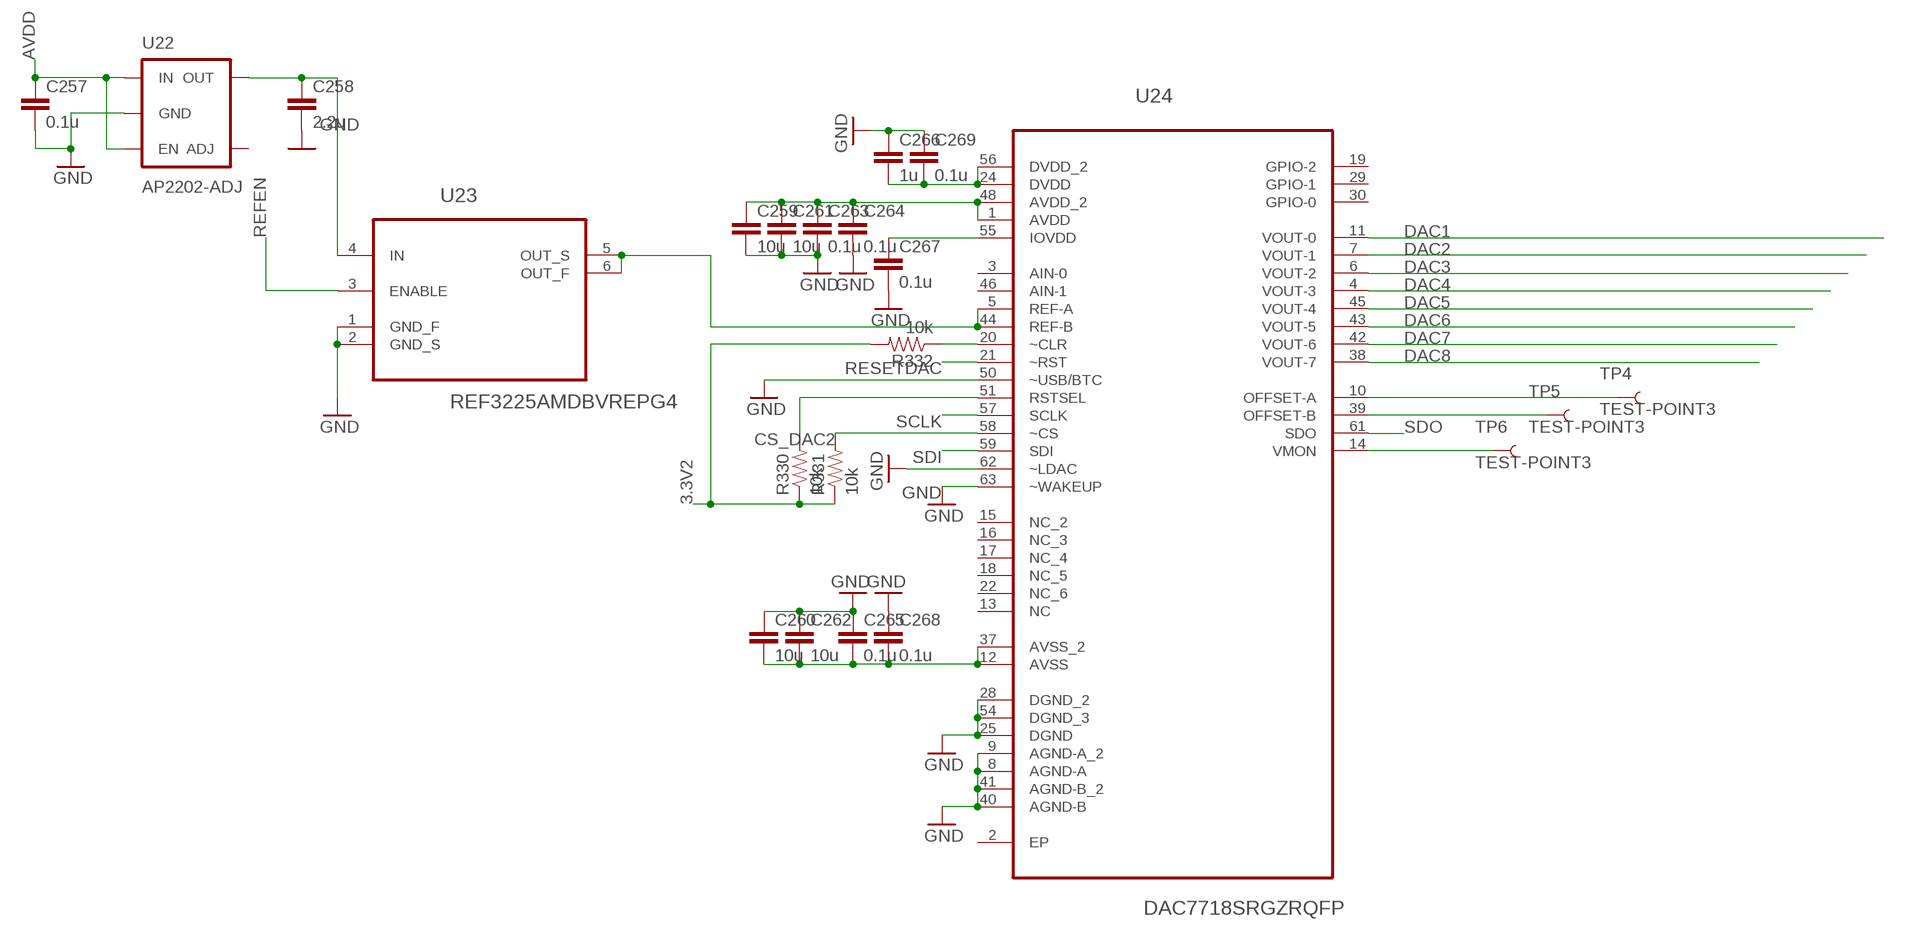
[diagram p9: schematic, sheet 10]

### Parts
C257  0.1u  CAP0402-CAP  [0402-CAP]
C258  2.2u  CAP0402-CAP  [0402-CAP]
C259  10u  CAP0805  [0805]
C260  10u  CAP0805  [0805]
C261  10u  CAP0805  [0805]
C262  10u  CAP0805  [0805]
C263  0.1u  CAP0402-CAP  [0402-CAP]
C264  0.1u  CAP0402-CAP  [0402-CAP]
C265  0.1u  CAP0402-CAP  [0402-CAP]
C266  1u  CAP0402-CAP  [0402-CAP]
C267  0.1u  CAP0402-CAP  [0402-CAP]
C268  0.1u  CAP0402-CAP  [0402-CAP]
C269  0.1u  CAP0402-CAP  [0402-CAP]
R330  10k  RESISTOR0402-RES  [0402-RES]
R331  10k  RESISTOR0402-RES  [0402-RES]
R332  10k  RESISTOR0402-RES  [0402-RES]
TP4  TEST-POINT3  [PAD.03X.03]
TP5  TEST-POINT3  [PAD.03X.03]
TP6  TEST-POINT3  [PAD.03X.03]
U22  AP2202-ADJ  [SOT23-5]
U23  REF3225AMDBVREPG4  [SOT95P280X145-6N]
U24  DAC7718SRGZRQFP  [QFP50P1200X1200X160-64N]

### Nets
3.3V2: C258.1 C266.2 C267.1 C269.2 R330.1 R331.1 R332.2 U22.5(OUT) U23.4(IN) U24.24(DVDD) U24.55(IOVDD) U24.56(DVDD_2)
AVDD: C257.1 C259.1 C261.1 C263.1 C264.1 U22.1(IN) U22.3(EN) U24.1(AVDD) U24.48(AVDD_2) ; also sheet 1,4,5,9
AVSS: C260.2 C262.2 C265.2 C268.2 U24.12(AVSS) U24.37(AVSS_2) ; also sheet 1,4,5,9
CS_DAC2: R331.2 U24.58(~CS) ; also sheet 3
DAC1: U24.11(VOUT-0) ; also sheet 16
DAC2: U24.7(VOUT-1) ; also sheet 17
DAC3: U24.6(VOUT-2) ; also sheet 18
DAC4: U24.4(VOUT-3) ; also sheet 19
DAC5: U24.45(VOUT-4) ; also sheet 20
DAC6: U24.43(VOUT-5) ; also sheet 21
DAC7: U24.42(VOUT-6) ; also sheet 22
DAC8: U24.38(VOUT-7) ; also sheet 23
GND: C257.2 C258.2 C259.2 C260.1 C261.2 C262.1 C263.2 C264.2 C265.1 C266.1 C267.2 C268.1 C269.1 U22.2(GND) U23.1(GND_F) U23.2(GND_S) U24.8(AGND-A) U24.9(AGND-A_2) U24.25(DGND) U24.28(DGND_2) U24.40(AGND-B) U24.41(AGND-B_2) U24.50(~USB/BTC) U24.54(DGND_3) U24.62(~LDAC) U24.63(~WAKEUP) ; also sheet 1,2,3,4,5,6,7,8,9,11,12,13,15,16,17,18,19,20,21,22,23,24,25,26,27,28,29,30,31
N$146: R330.2 U24.51(RSTSEL)
N$147: R332.1 U24.20(~CLR)
N$161: TP4.P$1 U24.10(OFFSET-A)
N$162: TP5.P$1 U24.39(OFFSET-B)
N$163: TP6.P$1 U24.14(VMON)
N$171: U23.5(OUT_S) U23.6(OUT_F) U24.5(REF-A) U24.44(REF-B)
REFEN: U23.3(ENABLE) ; also sheet 3,9
RESETDAC: U24.21(~RST) ; also sheet 3,9
SCLK: U24.57(SCLK) ; also sheet 3,5,9
SDI: U24.59(SDI) ; also sheet 3,5,9
SDO: U24.61(SDO) ; also sheet 3,5,9
Unconnected: U22.4(ADJ) U24.2(EP) U24.3(AIN-0) U24.13(NC) U24.15(NC_2) U24.16(NC_3) U24.17(NC_4) U24.18(NC_5) U24.19(GPIO-2) U24.22(NC_6) U24.29(GPIO-1) U24.30(GPIO-0) U24.46(AIN-1)

## Sheet 11 of 31
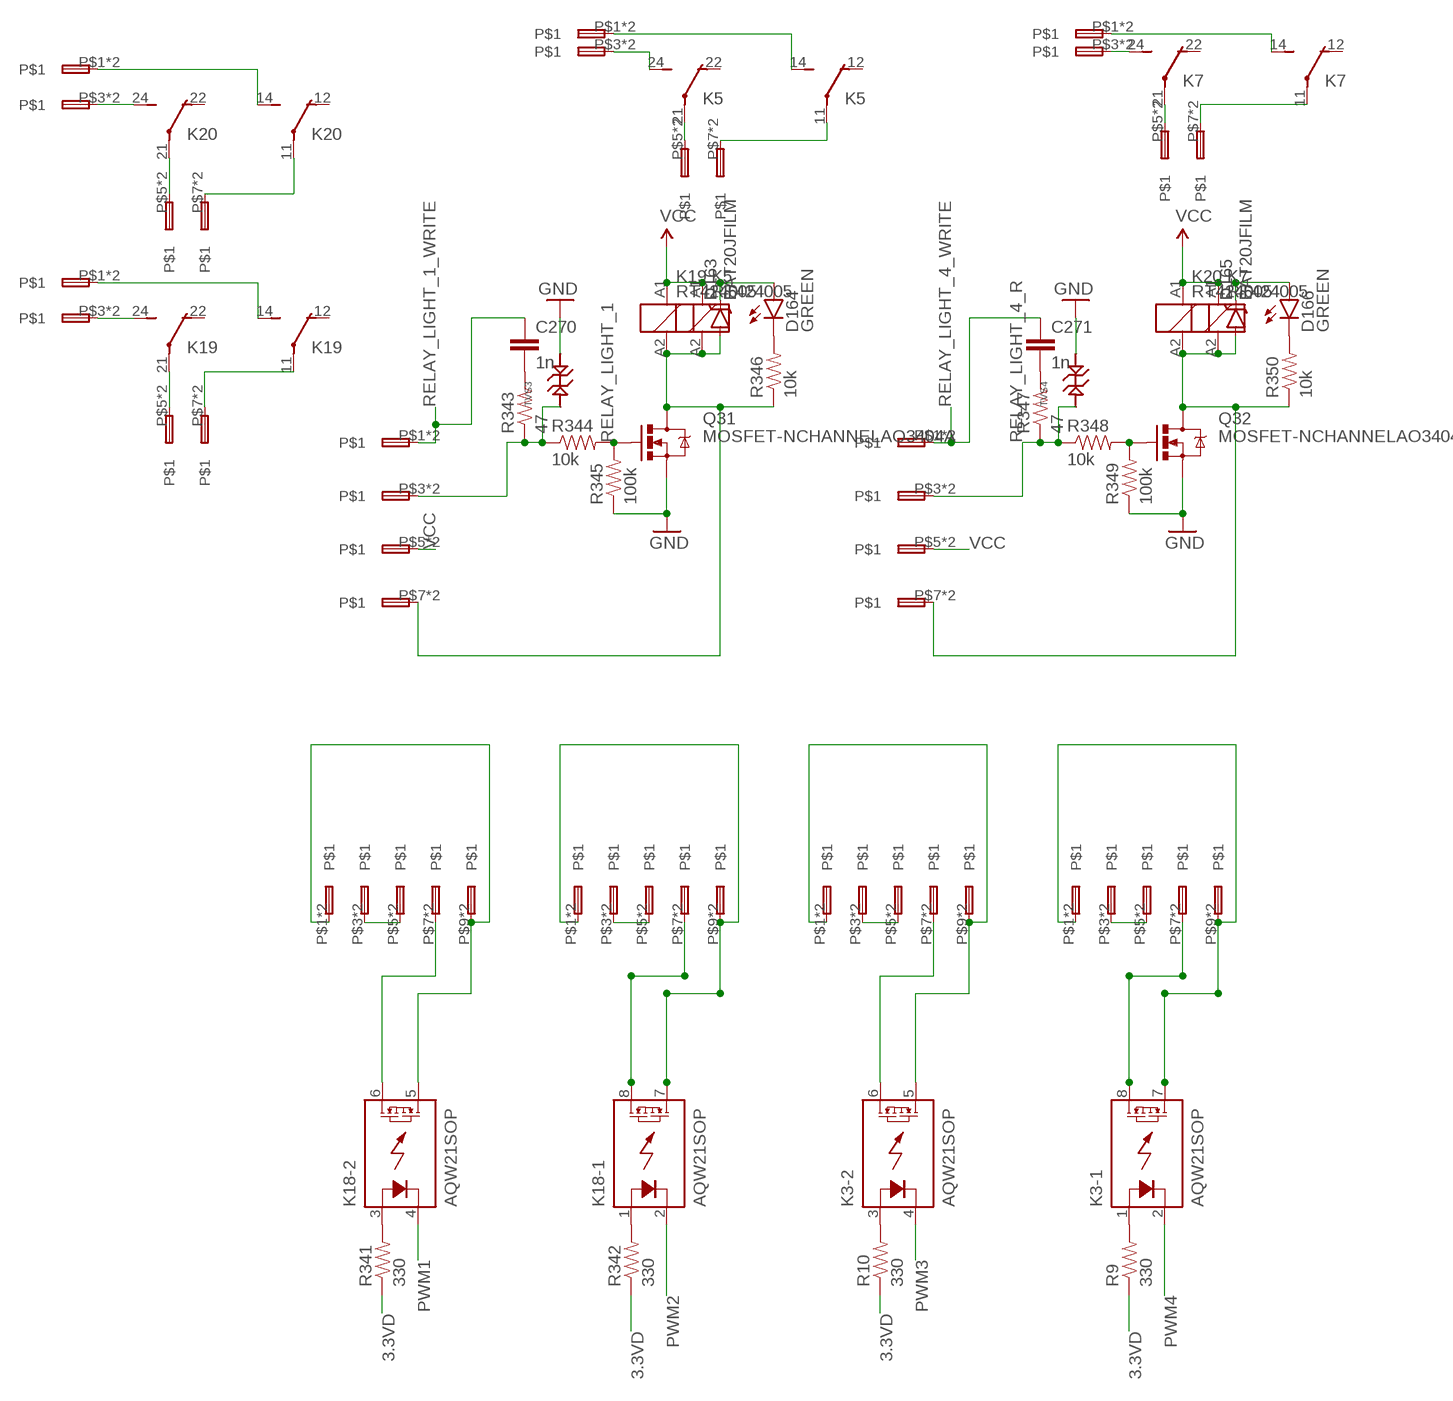
[diagram p10: schematic, sheet 11]

### Parts
C270  1n  CAP0402-CAP  [0402-CAP]
C271  1n  CAP0402-CAP  [0402-CAP]
D163  BAT20JFILM  [SOD-323]
D164  GREEN  LED0603  [LED-0603]
D165  BAT20JFILM  [SOD-323]
D166  GREEN  LED0603  [LED-0603]
K3  AQW21SOP  [SOP08]
K5  RT424005  [RT2C/O]
K7  RT424005  [RT2C/O]
K18  AQW21SOP  [SOP08]
K19  RT424005  [RT2C/O]
K20  RT424005  [RT2C/O]
Q31  MOSFET-NCHANNELAO3404A  [SOT23-3]
Q32  MOSFET-NCHANNELAO3404A  [SOT23-3]
R9  330  RESISTOR0402-RES  [0402-RES]
R10  330  RESISTOR0402-RES  [0402-RES]
R341  330  RESISTOR0402-RES  [0402-RES]
R342  330  RESISTOR0402-RES  [0402-RES]
R343  47  RESISTOR0402-RES  [0402-RES]
R344  10k  RESISTOR0402-RES  [0402-RES]
R345  100k  RESISTOR0402-RES  [0402-RES]
R346  10k  RESISTOR0402-RES  [0402-RES]
R347  47  RESISTOR0402-RES  [0402-RES]
R348  10k  RESISTOR0402-RES  [0402-RES]
R349  100k  RESISTOR0402-RES  [0402-RES]
R350  10k  RESISTOR0402-RES  [0402-RES]
TVS3  TVS_DIODE_SOD-323  [SOD-323]
TVS4  TVS_DIODE_SOD-323  [SOD-323]
X5  SPTAF1/5-3.5  [SPTAF1/5-3.5]
X6  SPTAF1/5-3.5  [SPTAF1/5-3.5]
X7  SPTAF1/4-3.5  [SPTAF1/4-3.5]
X8  SPTAF1/4-3.5  [SPTAF1/4-3.5]
X9  SPTAF1/4-3.5  [SPTAF1/4-3.5]
X10  SPTAF1/4-3.5  [SPTAF1/4-3.5]
X11  SPTAF1/5-3.5  [SPTAF1/5-3.5]
X12  SPTAF1/5-3.5  [SPTAF1/5-3.5]
X66  SPTAF1/4-3.5  [SPTAF1/4-3.5]
X67  SPTAF1/4-3.5  [SPTAF1/4-3.5]

### Nets
3.3VD: R9.1 R10.1 R341.1 R342.1 ; also sheet 1,2,3,4,5,6,12,13,15
GND: Q31.2(S) Q32.2(S) R345.1 R349.1 TVS3.CATH TVS4.CATH ; also sheet 1,2,3,4,5,6,7,8,9,10,12,13,15,16,17,18,19,20,21,22,23,24,25,26,27,28,29,30,31
N$11: K3.1(-1:A) R9.2
N$12: K3.3(-2:A) R10.2
N$13: K3.7(-1:D2) X6.P$1 X6.P$2 X6.P$9 X6.P$10
N$14: K3.8(-1:D1) X6.P$7 X6.P$8
N$15: K3.6(-2:D1) X5.P$7 X5.P$8
N$16: K3.5(-2:D2) X5.P$1 X5.P$2 X5.P$9 X5.P$10
N$17: X5.P$3 X5.P$4 X5.P$5 X5.P$6
N$18: X6.P$3 X6.P$4 X6.P$5 X6.P$6
N$19: K5.14(2:S) X9.P$1 X9.P$2
N$97: K5.11(2:P) X9.P$7 X9.P$8
N$99: K7.24(3:S) X10.P$3 X10.P$4
N$100: K7.14(2:S) X10.P$1 X10.P$2
N$101: K7.21(3:P) X10.P$5 X10.P$6
N$102: K5.21(3:P) X9.P$5 X9.P$6
N$103: K5.24(3:S) X9.P$3 X9.P$4
N$104: K7.11(2:P) X10.P$7 X10.P$8
N$243: C270.2 R343.2
N$249: C271.2 R347.2
N$258: K18.1(-1:A) R342.2
N$259: K18.3(-2:A) R341.2
N$260: K18.7(-1:D2) X12.P$1 X12.P$2 X12.P$9 X12.P$10
N$261: K18.8(-1:D1) X12.P$7 X12.P$8
N$262: K18.6(-2:D1) X11.P$7 X11.P$8
N$263: K18.5(-2:D2) X11.P$1 X11.P$2 X11.P$9 X11.P$10
N$268: K19.21(3:P) X8.P$5 X8.P$6
N$269: K19.11(2:P) X8.P$7 X8.P$8
N$270: K19.14(2:S) X8.P$1 X8.P$2
N$271: K20.21(3:P) X7.P$5 X7.P$6
N$272: K20.11(2:P) X7.P$7 X7.P$8
N$273: K20.14(2:S) X7.P$1 X7.P$2
N$274: K19.24(3:S) X8.P$3 X8.P$4
N$275: K20.24(3:S) X7.P$3 X7.P$4
N$276: X11.P$3 X11.P$4 X11.P$5 X11.P$6
N$277: X12.P$3 X12.P$4 X12.P$5 X12.P$6
N$278: D164.C R346.2
N$279: D166.C R350.2
N$280: D163.A K5.A2 K19.A2 Q31.3(D) R346.1 X66.P$7 X66.P$8
N$281: D165.A K7.A2 K20.A2 Q32.3(D) R350.1 X67.P$7 X67.P$8
PWM1: K18.4(-2:K) ; also sheet 2
PWM2: K18.2(-1:K) ; also sheet 2
PWM3: K3.4(-2:K) ; also sheet 2
PWM4: K3.2(-1:K) ; also sheet 2
RELAY_LIGHT_1: Q31.1(G) R344.2 R345.2 ; also sheet 2
RELAY_LIGHT_1_R: R343.1 R344.1 TVS3.ANODE X66.P$3 X66.P$4
RELAY_LIGHT_1_WRITE: C270.1 X66.P$1 X66.P$2 ; also sheet 6
RELAY_LIGHT_4: Q32.1(G) R348.2 R349.2 ; also sheet 2
RELAY_LIGHT_4_R: R347.1 R348.1 TVS4.ANODE X67.P$3 X67.P$4
RELAY_LIGHT_4_WRITE: C271.1 X67.P$1 X67.P$2 ; also sheet 6
VCC: D163.C D164.A D165.C D166.A K5.A1 K7.A1 K19.A1 K20.A1 X66.P$5 X66.P$6 X67.P$5 X67.P$6 ; also sheet 1,2,3,7,8,13,15,16,17,18,19,20,21,22,23,24,25,26,27,28,29,30,31
Unconnected: K5.12(2:O) K5.22(3:O) K7.12(2:O) K7.22(3:O) K19.12(2:O) K19.22(3:O) K20.12(2:O) K20.22(3:O)

## Sheet 12 of 31
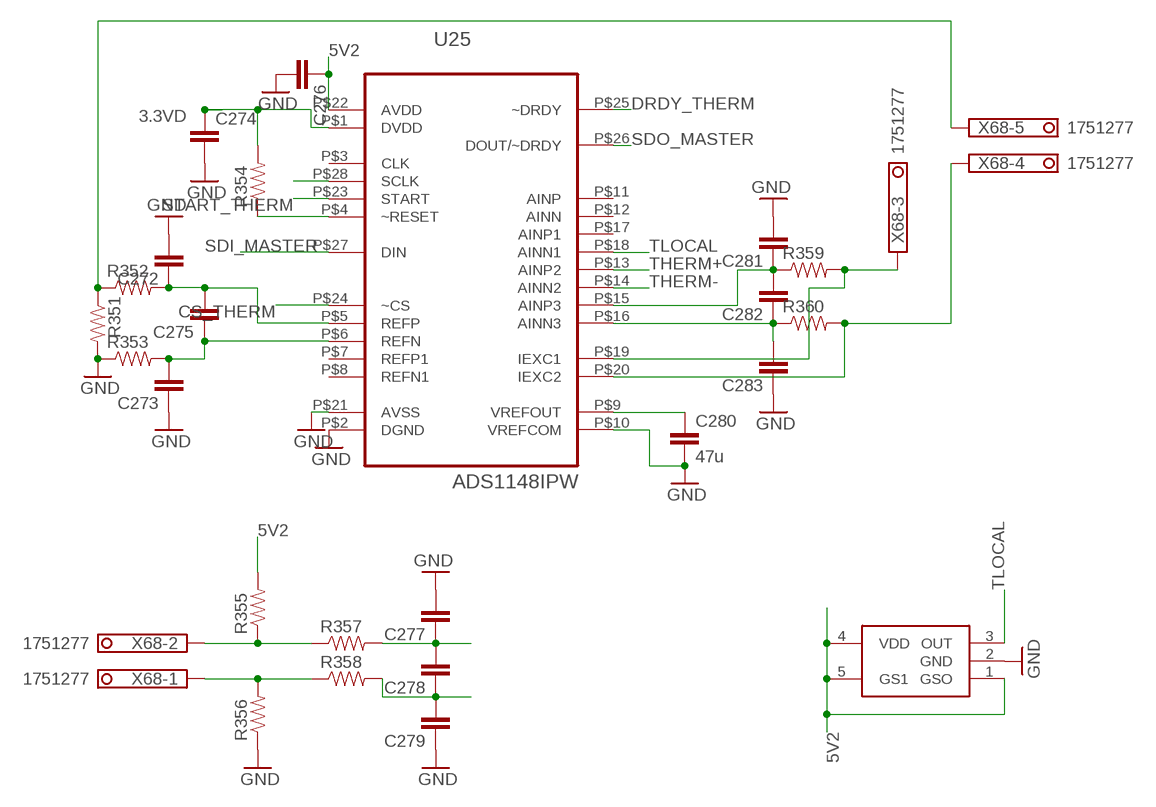
[diagram p11: schematic, sheet 12]

### Parts
C272  CAP0402-CAP  [0402-CAP]
C273  CAP0402-CAP  [0402-CAP]
C274  CAP0402-CAP  [0402-CAP]
C275  CAP0402-CAP  [0402-CAP]
C276  CAP0402-CAP  [0402-CAP]
C277  CAP0402-CAP  [0402-CAP]
C278  CAP0402-CAP  [0402-CAP]
C279  CAP0402-CAP  [0402-CAP]
C280  47u  CAP0805  [0805]
C281  CAP0402-CAP  [0402-CAP]
C282  CAP0402-CAP  [0402-CAP]
C283  CAP0402-CAP  [0402-CAP]
R351  RESISTOR0402-RES  [0402-RES]
R352  RESISTOR0402-RES  [0402-RES]
R353  RESISTOR0402-RES  [0402-RES]
R354  RESISTOR0402-RES  [0402-RES]
R355  RESISTOR0402-RES  [0402-RES]
R356  RESISTOR0402-RES  [0402-RES]
R357  RESISTOR0402-RES  [0402-RES]
R358  RESISTOR0402-RES  [0402-RES]
R359  RESISTOR0402-RES  [0402-RES]
R360  RESISTOR0402-RES  [0402-RES]
U25  ADS1148IPW  [R-PDSO-G28]
U26  LM94022  [SOT65P210X110-5N]
X68  1751277  [1751277]

### Nets
3.3VD: C274.1 R354.2 U25.P$1(DVDD) ; also sheet 1,2,3,4,5,6,11,13,15
5V2: C276.1 R355.2 U25.P$22(AVDD) U26.1(GSO) U26.4(VDD) U26.5(GS1) ; also sheet 1
CS_THERM: U25.P$24(~CS) ; also sheet 2
DRDY_THERM: U25.P$25(~DRDY) ; also sheet 2
GND: C272.2 C273.1 C274.2 C276.2 C277.2 C279.1 C280.2 C281.2 C283.1 R351.2 R353.1 R356.1 U25.P$2(DGND) U25.P$10(VREFCOM) U25.P$21(AVSS) U26.2(GND) ; also sheet 1,2,3,4,5,6,7,8,9,10,11,13,15,16,17,18,19,20,21,22,23,24,25,26,27,28,29,30,31
N$239: R355.1 R357.1 X68.2
N$264: R356.2 R358.1 X68.1
N$292: C272.1 C275.2 R352.2 U25.P$5(REFP)
N$296: C273.2 C275.1 R353.2 U25.P$6(REFN)
N$298: C280.1 U25.P$9(VREFOUT)
N$300: C282.1 C283.2 R360.1 U25.P$16(AINN3)
N$302: C281.1 C282.2 R359.1 U25.P$15(AINP3)
N$303: R351.1 R352.1 X68.5
N$304: R359.2 U25.P$19(IEXC1) X68.3
N$305: R360.2 U25.P$20(IEXC2) X68.4
RESET: R354.1 U25.P$4(~RESET) ; also sheet 2,3,5
SCLK_MASTER: U25.P$28(SCLK) ; also sheet 2,6
SDI_MASTER: U25.P$27(DIN) ; also sheet 2,6
SDO_MASTER: U25.P$26(DOUT/~DRDY) ; also sheet 2
START_THERM: U25.P$23(START) ; also sheet 2
THERM+: C277.1 C278.2 R357.2 U25.P$13(AINP2)
THERM-: C278.1 C279.2 R358.2 U25.P$14(AINN2)
TLOCAL: U25.P$18(AINN1) U26.3(OUT)
Unconnected: U25.P$3(CLK) U25.P$7(REFP1) U25.P$8(REFN1) U25.P$11(AINP) U25.P$12(AINN) U25.P$17(AINP1)

## Sheet 13 of 31: SSR
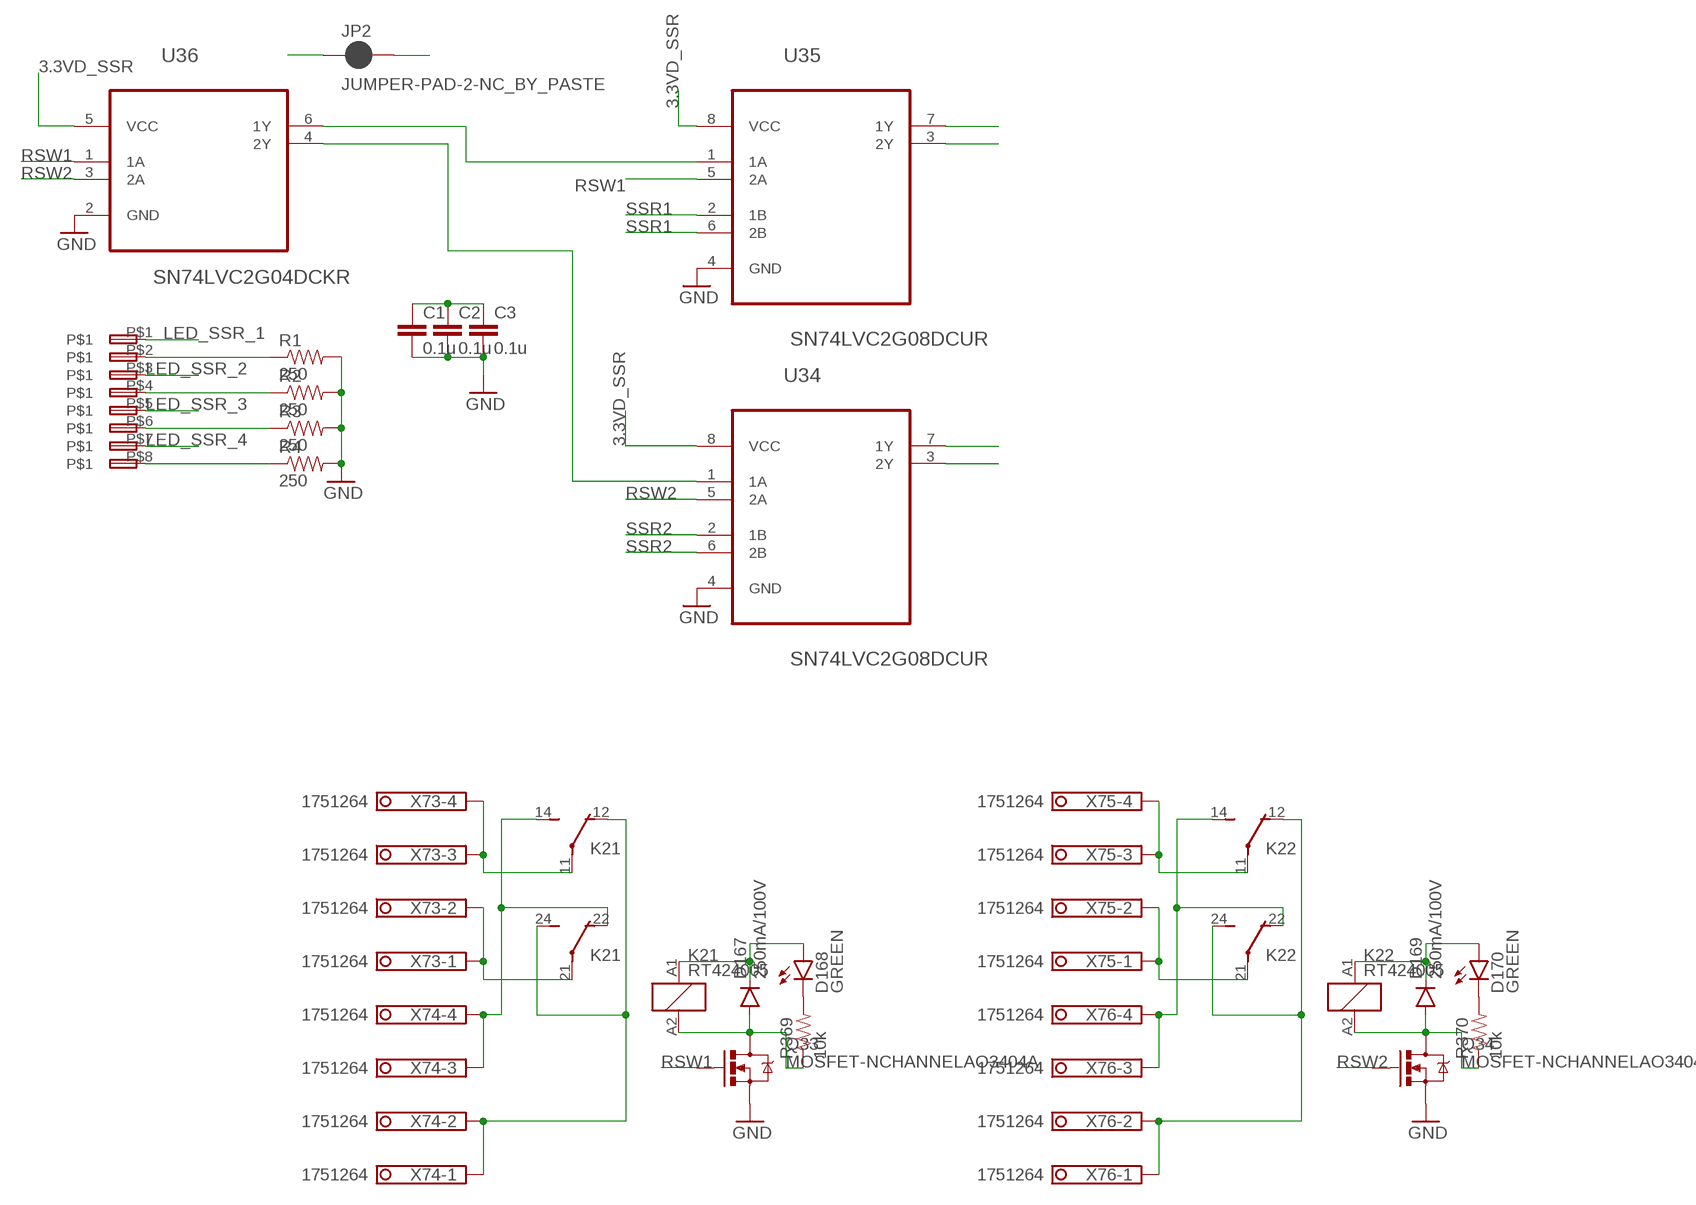
[diagram p12: schematic, sheet 13]

### Parts
C1  0.1u  CAP0402-CAP  [0402-CAP]
C2  0.1u  CAP0402-CAP  [0402-CAP]
C3  0.1u  CAP0402-CAP  [0402-CAP]
D167  250mA/100V  DIODEBAS16  [SOD-323]
D168  GREEN  LED0603  [LED-0603]
D169  250mA/100V  DIODEBAS16  [SOD-323]
D170  GREEN  LED0603  [LED-0603]
JP2  JUMPER-PAD-2-NC_BY_PASTE  [PAD-JUMPER-2-NC_BY_PASTE_YES_SILK]
K21  RT424005  [RT2C/O]
K22  RT424005  [RT2C/O]
Q33  MOSFET-NCHANNELAO3404A  [SOT23-3]
Q34  MOSFET-NCHANNELAO3404A  [SOT23-3]
R1  250  RESISTOR0402-RES  [0402-RES]
R2  250  RESISTOR0402-RES  [0402-RES]
R3  250  RESISTOR0402-RES  [0402-RES]
R4  250  RESISTOR0402-RES  [0402-RES]
R369  10k  RESISTOR0402-RES  [0402-RES]
R370  10k  RESISTOR0402-RES  [0402-RES]
U34  SN74LVC2G08DCUR  [SOP50P310X90-8N]
U35  SN74LVC2G08DCUR  [SOP50P310X90-8N]
U36  SN74LVC2G04DCKR  [SOT65P210X110-6N]
U$11  PTSA0,5/42,5  [PTSA0,5/8-2,5-Z]
X73  1751264  [1751264]
X74  1751264  [1751264]
X75  1751264  [1751264]
X76  1751264  [1751264]

### Nets
3.3VD: JP2.1 ; also sheet 1,2,3,4,5,6,11,12,15
3.3VD_SSR: C1.1 C2.1 C3.1 JP2.2 U34.8(VCC) U35.8(VCC) U36.5(VCC)
GND: C1.2 C2.2 C3.2 Q33.2(S) Q34.2(S) R1.2 R2.2 R3.2 R4.2 U34.4(GND) U35.4(GND) U36.2(GND) ; also sheet 1,2,3,4,5,6,7,8,9,10,11,12,15,16,17,18,19,20,21,22,23,24,25,26,27,28,29,30,31
LED_SSR_1: U34.3(2Y) U$11.P$1
LED_SSR_2: U34.7(1Y) U$11.P$3
LED_SSR_3: U35.3(2Y) U$11.P$5
LED_SSR_4: U35.7(1Y) U$11.P$7
N$3: U35.1(1A) U36.6(1Y)
N$4: U34.1(1A) U36.4(2Y)
N$36: K21.11(2:P) X73.3 X73.4
N$37: K21.21(3:P) X73.1 X73.2
N$38: K21.14(2:S) K21.22(3:O) X74.3 X74.4
N$39: K22.11(2:P) X75.3 X75.4
N$40: K21.12(2:O) K21.24(3:S) X74.1 X74.2
N$80: D167.A K21.A2 Q33.3(D) R369.1
N$81: D168.C R369.2
N$82: K22.21(3:P) X75.1 X75.2
N$87: K22.14(2:S) K22.22(3:O) X76.3 X76.4
N$88: K22.12(2:O) K22.24(3:S) X76.1 X76.2
N$89: D169.A K22.A2 Q34.3(D) R370.1
N$90: D170.C R370.2
N$106: R1.1 U$11.P$2
N$108: R2.1 U$11.P$4
N$110: R3.1 U$11.P$6
N$112: R4.1 U$11.P$8
RSW1: Q33.1(G) U35.5(2A) U36.1(1A) ; also sheet 6
RSW2: Q34.1(G) U34.5(2A) U36.3(2A) ; also sheet 6
SSR1: U35.2(1B) U35.6(2B) ; also sheet 2
SSR2: U34.2(1B) U34.6(2B) ; also sheet 2
VCC: D167.C D168.A D169.C D170.A K21.A1 K22.A1 ; also sheet 1,2,3,7,8,11,15,16,17,18,19,20,21,22,23,24,25,26,27,28,29,30,31

## Sheet 14 of 31
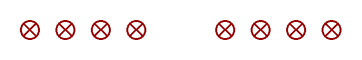
[diagram p13: schematic, sheet 14]

### Parts
U$48  FIDUCIAL  [FIDUCIAL]
U$49  FIDUCIAL  [FIDUCIAL]
U$50  FIDUCIAL  [FIDUCIAL]
U$59  FIDUCIAL  [FIDUCIAL]
U$60  FIDUCIAL  [FIDUCIAL]
U$62  FIDUCIAL  [FIDUCIAL]
U$63  FIDUCIAL  [FIDUCIAL]
U$64  FIDUCIAL  [FIDUCIAL]

## Sheet 15 of 31
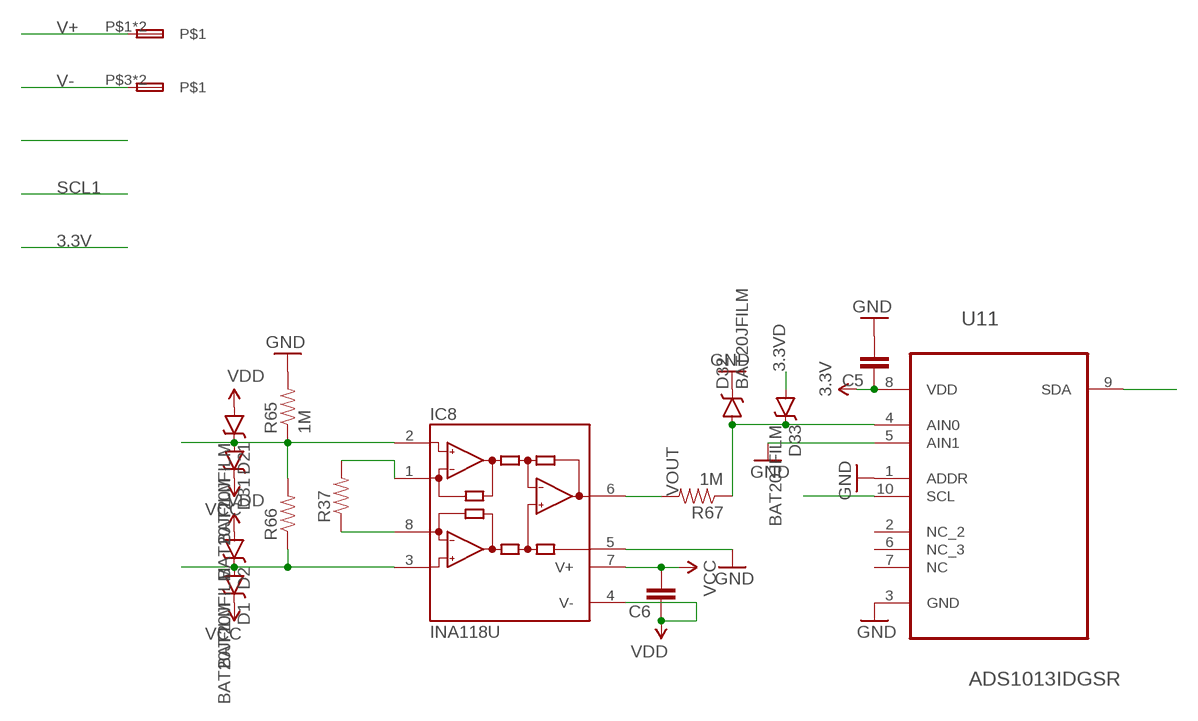
[diagram p14: schematic, sheet 15]

### Parts
C5  CAP0402-CAP  [0402-CAP]
C6  CAP0402-CAP  [0402-CAP]
D1  BAT20JFILM  [SOD-323]
D2  BAT20JFILM  [SOD-323]
D21  BAT20JFILM  [SOD-323]
D31  BAT20JFILM  [SOD-323]
D32  BAT20JFILM  [SOD-323]
D33  BAT20JFILM  [SOD-323]
IC8  INA118U  [SO08]
R37  RESISTOR0603-RES  [0603-RES]
R65  1M  RESISTOR0603-RES  [0603-RES]
R66  RESISTOR2512  [R2512]
R67  1M  RESISTOR0603-RES  [0603-RES]
U11  ADS1013IDGSR  [SOP50P490X110-10N]
X3  SPTAF1/2-3.5  [SPTAF1/2-3.5]

### Nets
3.3VD: C5.1 D33.A U11.8(VDD) ; supply symbol labelled 3.3V ; also sheet 1,2,3,4,5,6,11,12,13
GND: C5.2 D32.C IC8.5(REF) R65.2 U11.1(ADDR) U11.3(GND) U11.5(AIN1) ; also sheet 1,2,3,4,5,6,7,8,9,10,11,12,13,16,17,18,19,20,21,22,23,24,25,26,27,28,29,30,31
N$114: IC8.1(RG) R37.2
N$115: IC8.8(RG) R37.1
N$116: IC8.6(OUT) R67.2
SCL: U11.10(SCL) ; also sheet 2,3
SDA: U11.9(SDA) ; also sheet 2,3
V+: D1.A D2.C IC8.3(+IN) R66.1 X3.P$1 X3.P$2
V-: D21.C D31.A IC8.2(-IN) R65.1 R66.2 X3.P$3 X3.P$4
VCC: C6.2 D1.C D31.C IC8.7(V+) ; also sheet 1,2,3,7,8,11,13,16,17,18,19,20,21,22,23,24,25,26,27,28,29,30,31
VDD: C6.1 D2.A D21.A IC8.4(V-) ; also sheet 1,3,7,8,16,17,18,19,20,21,22,23,24,25,26,27,28,29,30,31
VOUT: D32.A D33.C R67.1 U11.4(AIN0)
Unconnected: U11.2(NC_2) U11.6(NC_3) U11.7(NC)

## Sheet 16 of 31
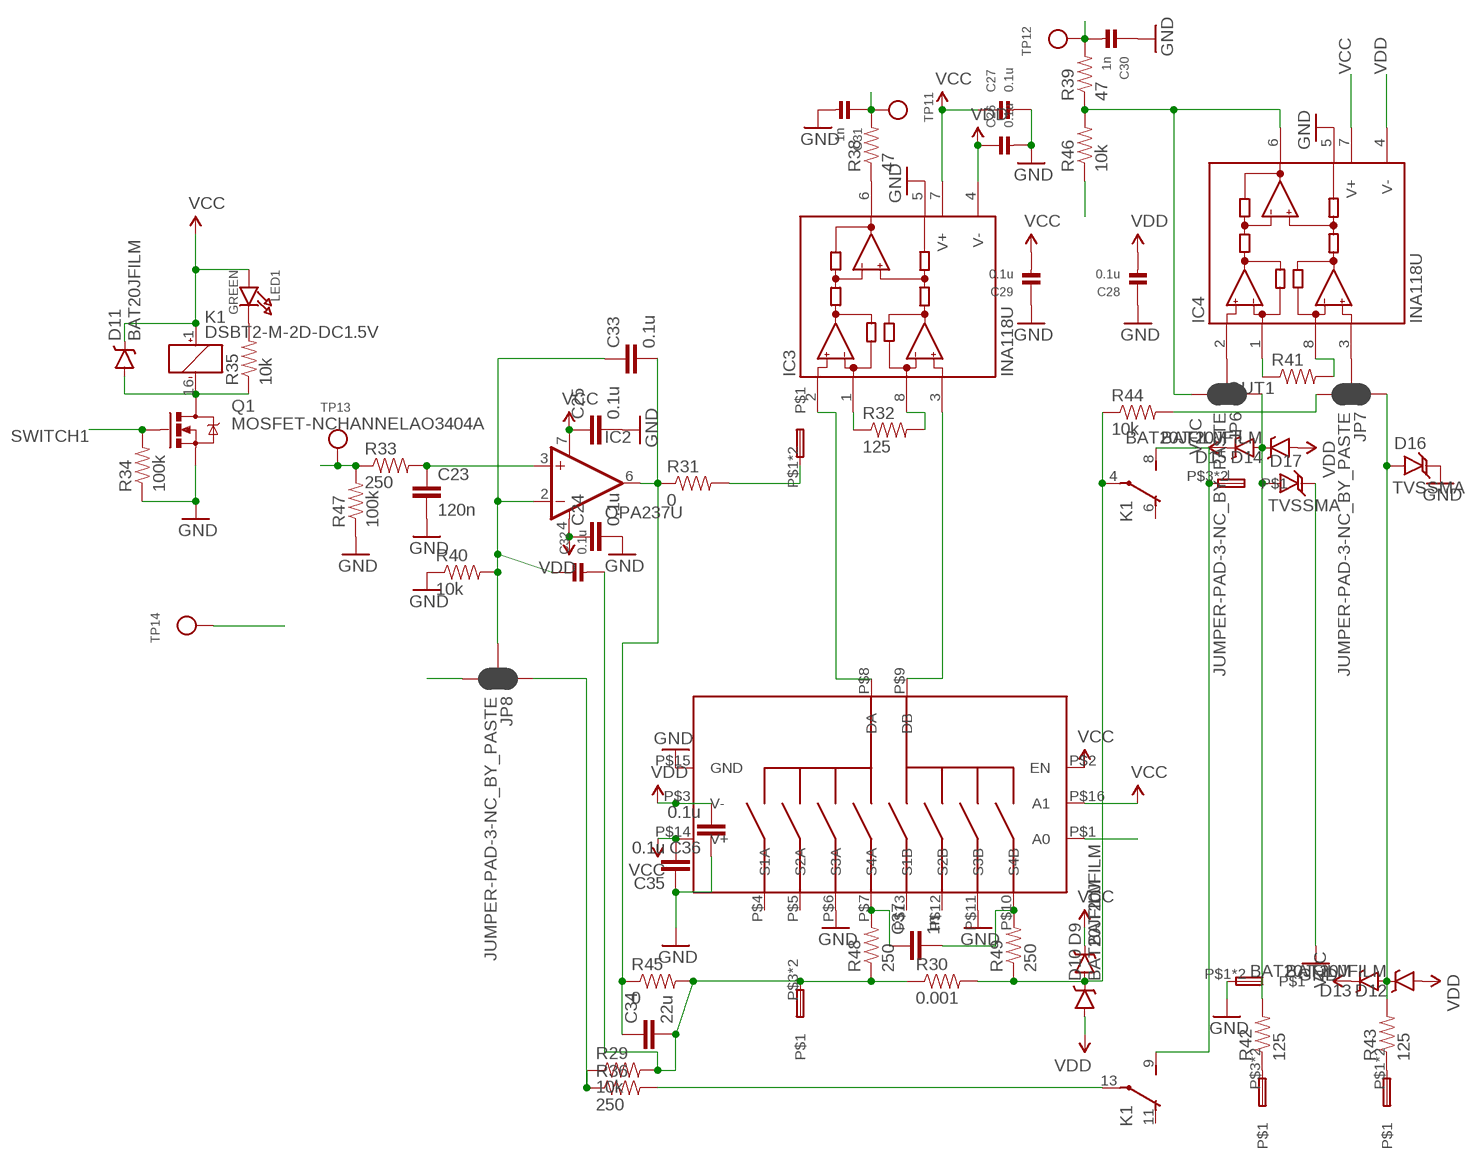
[diagram p15: schematic, sheet 16]

### Parts
C23  120n  CAP0402-CAP  [0402-CAP]
C24  0.1u  CAP0402-CAP  [0402-CAP]
C25  0.1u  CAP0402-CAP  [0402-CAP]
C26  0.1u  CAP_CERAMIC0402  [0402]
C27  0.1u  CAP_CERAMIC0402  [0402]
C28  0.1u  CAP_CERAMIC0402  [0402]
C29  0.1u  CAP_CERAMIC0402  [0402]
C30  1n  CAP_CERAMIC0402  [0402]
C31  1n  CAP_CERAMIC0402  [0402]
C32  0.1u  CAP_CERAMIC0402  [0402]
C33  0.1u  CAP0603-CAP  [0603-CAP]
C34  22u  CAP0805  [0805]
C35  0.1u  CAP0402-CAP  [0402-CAP]
C36  0.1u  CAP0402-CAP  [0402-CAP]
C37  1n  CAP0402-CAP  [0402-CAP]
D9  BAT20JFILM  [SOD-323]
D10  BAT20JFILM  [SOD-323]
D11  BAT20JFILM  [SOD-323]
D12  BAT20JFILM  [SOD-323]
D13  BAT20JFILM  [SOD-323]
D14  BAT20JFILM  [SOD-323]
D15  BAT20JFILM  [SOD-323]
D16  TVSSMA  [SMA-DIODE]
D17  TVSSMA  [SMA-DIODE]
IC2  OPA237U  [SO08]
IC3  INA118U  [SO08]
IC4  INA118U  [SO08]
JP6  JUMPER-PAD-3-NC_BY_PASTE  [PAD-JUMPER-3-NC_BY_PASTE_YES_SILK_FULL_BOX]
JP7  JUMPER-PAD-3-NC_BY_PASTE  [PAD-JUMPER-3-NC_BY_PASTE_YES_SILK_FULL_BOX]
JP8  JUMPER-PAD-3-NC_BY_PASTE  [PAD-JUMPER-3-NC_BY_PASTE_YES_SILK_FULL_BOX]
K1  DSBT2-M-2D-DC1.5V  [DS-BT]
LED1  GREEN  LED0603  [CHIPLED_0603]
Q1  MOSFET-NCHANNELAO3404A  [SOT23-3]
R29  10k  RESISTOR0402-RES  [0402-RES]
R30  0.001  0.001OHM-3W-1%(2512)3W/1%  [2512]
R31  0  RESISTOR0402-RES  [0402-RES]
R32  125  RESISTOR1206  [1206]
R33  250  RESISTOR0402-RES  [0402-RES]
R34  100k  RESISTOR0402-RES  [0402-RES]
R35  10k  RESISTOR0402-RES  [0402-RES]
R36  250  RESISTOR0402-RES  [0402-RES]
R38  47  RESISTOR0402-RES  [0402-RES]
R39  47  RESISTOR0402-RES  [0402-RES]
R40  10k  RESISTOR0402-RES  [0402-RES]
R41  RESISTOR1206  [1206]
R42  125  RESISTOR0402-RES  [0402-RES]
R43  125  RESISTOR0402-RES  [0402-RES]
R44  10k  RESISTOR0402-RES  [0402-RES]
R45  0  RESISTOR0805-RES  [0805]
R46  10k  RESISTOR0402-RES  [0402-RES]
R47  100k  RESISTOR0402-RES  [0402-RES]
R48  250  RESISTOR0402-RES  [0402-RES]
R49  250  RESISTOR0402-RES  [0402-RES]
TP11  TESTPOINT0.1"  [1X01_ROUND]
TP12  TESTPOINT0.1"  [1X01_ROUND]
TP13  TESTPOINT0.1"  [1X01_ROUND]
TP14  TESTPOINT0.1"  [1X01_ROUND]
U$5  SPTAF1/2-3.5  [SPTAF1/2-3.5]
U$6  SPTAF1/2-3.5  [SPTAF1/2-3.5]
U$7  SPTAF1/2-3.5  [SPTAF1/2-3.5]
U$8  MUX509  [R-PDSO-G16]

### Nets
A0: TP14.1 U$8.P$1(A0) ; also sheet 2,17,18,19,20,21,22,23,24,25,26,27,28,29,30,31
DAC1: R33.1 R47.2 TP13.1 ; also sheet 10
FB1: JP8.3 R46.1
GND: C23.2 C24.2 C25.2 C26.2 C27.2 C28.1 C29.1 C30.1 C31.2 C35.1 C36.1 D16.C D17.C IC3.5(REF) IC4.5(REF) Q1.2(S) R34.1 R40.1 R47.1 U$6.P$1 U$6.P$2 U$8.P$6(S3A) U$8.P$11(S3B) U$8.P$15(GND) ; also sheet 1,2,3,4,5,6,7,8,9,10,11,12,13,15,17,18,19,20,21,22,23,24,25,26,27,28,29,30,31
N$20: D9.A D10.C K1.4(2:P) R30.2 R44.1 R49.1
N$21: K1.13(3:P) R36.2
N$22: IC3.1(RG) R32.1
N$23: IC3.8(RG) R32.2
N$24: C23.1 IC2.3(+IN) R33.2
N$25: D11.A K1.16(1:-) Q1.3(D) R35.1
N$26: LED1.C R35.2
N$27: C32.1 C33.1 IC2.2(-IN) JP8.2 R40.2
N$29: C32.2 C34.2 R29.2 R30.1 R45.2 R48.1 U$5.P$3 U$5.P$4
N$32: IC3.6(OUT) R38.1
N$35: IC4.6(OUT) JP6.3 R39.1 R46.2
N$41: C33.2 C34.1 IC2.6(OUT) R31.1 R45.1
N$42: IC4.1(RG) R41.1
N$43: IC4.8(RG) R41.2
N$44: IC4.2(-IN) JP6.2
N$45: IC4.3(+IN) JP7.2
N$46: D14.C D15.A D17.A JP6.1 R42.2
N$47: R42.1 U$7.P$3 U$7.P$4
N$48: D12.C D13.A D16.A JP7.1 R43.2
N$49: R43.1 U$7.P$1 U$7.P$2
N$50: JP7.3 R44.2
N$51: JP8.1 R29.1 R36.1
N$52: R31.2 U$5.P$1 U$5.P$2
N$53: IC3.2(-IN) U$8.P$8(DA)
N$54: IC3.3(+IN) U$8.P$9(DB)
N$55: C37.2 R49.2 U$8.P$10(S4B)
N$56: C37.1 R48.2 U$8.P$7(S4A)
OUT1: K1.8(2:S) K1.9(3:S) U$6.P$3 U$6.P$4
SENSEI1: C31.1 R38.2 TP11.1 ; also sheet 8
SENSEV1: C30.2 R39.2 TP12.1 ; also sheet 8
SWITCH1: Q1.1(G) R34.2 ; also sheet 6
VCC: C25.1 C27.1 C29.2 C35.2 D9.C D11.C D13.C D15.C IC2.7(V+) IC3.7(V+) IC4.7(V+) K1.1(1:+) LED1.A U$8.P$2(EN) U$8.P$14(V+) U$8.P$16(A1) ; also sheet 1,2,3,7,8,11,13,15,17,18,19,20,21,22,23,24,25,26,27,28,29,30,31
VDD: C24.1 C26.1 C28.2 C36.2 D10.A D12.A D14.A IC2.4(V-) IC3.4(V-) IC4.4(V-) U$8.P$3(V-) ; also sheet 1,3,7,8,15,17,18,19,20,21,22,23,24,25,26,27,28,29,30,31
Unconnected: K1.6(2:O) K1.11(3:O) U$8.P$4(S1A) U$8.P$5(S2A) U$8.P$12(S2B) U$8.P$13(S1B)

## Sheet 17 of 31
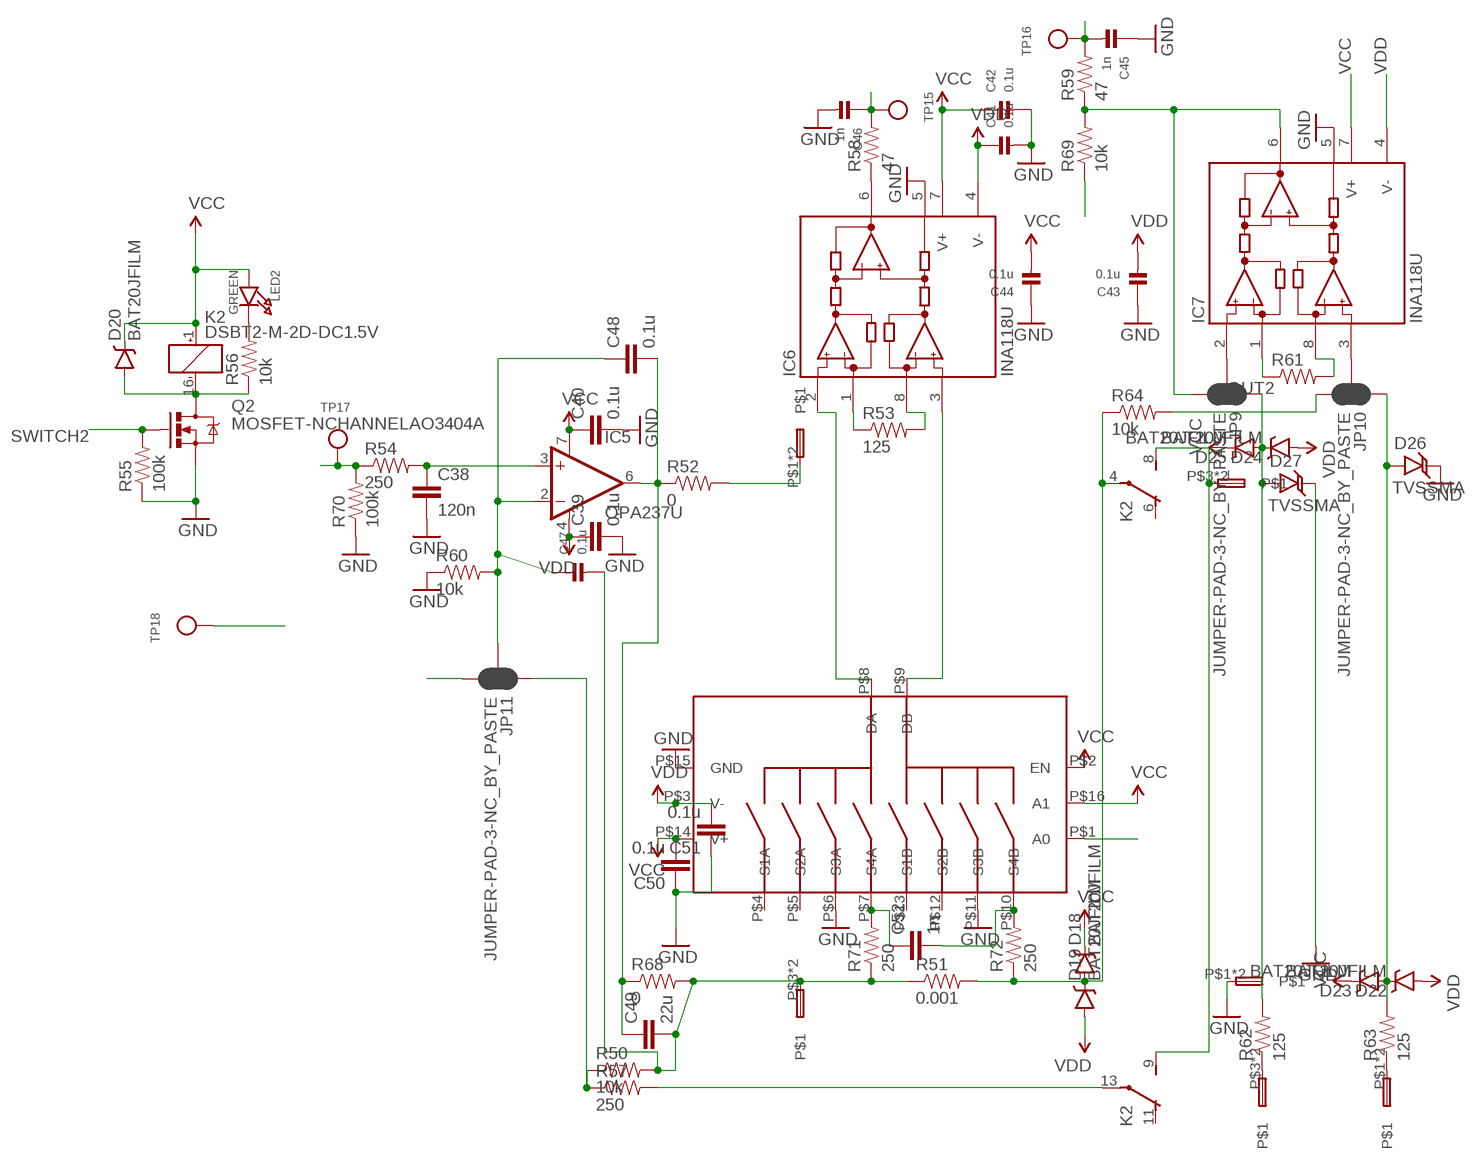
[diagram p16: schematic, sheet 17]

### Parts
C38  120n  CAP0402-CAP  [0402-CAP]
C39  0.1u  CAP0402-CAP  [0402-CAP]
C40  0.1u  CAP0402-CAP  [0402-CAP]
C41  0.1u  CAP_CERAMIC0402  [0402]
C42  0.1u  CAP_CERAMIC0402  [0402]
C43  0.1u  CAP_CERAMIC0402  [0402]
C44  0.1u  CAP_CERAMIC0402  [0402]
C45  1n  CAP_CERAMIC0402  [0402]
C46  1n  CAP_CERAMIC0402  [0402]
C47  0.1u  CAP_CERAMIC0402  [0402]
C48  0.1u  CAP0603-CAP  [0603-CAP]
C49  22u  CAP0805  [0805]
C50  0.1u  CAP0402-CAP  [0402-CAP]
C51  0.1u  CAP0402-CAP  [0402-CAP]
C52  1n  CAP0402-CAP  [0402-CAP]
D18  BAT20JFILM  [SOD-323]
D19  BAT20JFILM  [SOD-323]
D20  BAT20JFILM  [SOD-323]
D22  BAT20JFILM  [SOD-323]
D23  BAT20JFILM  [SOD-323]
D24  BAT20JFILM  [SOD-323]
D25  BAT20JFILM  [SOD-323]
D26  TVSSMA  [SMA-DIODE]
D27  TVSSMA  [SMA-DIODE]
IC5  OPA237U  [SO08]
IC6  INA118U  [SO08]
IC7  INA118U  [SO08]
JP9  JUMPER-PAD-3-NC_BY_PASTE  [PAD-JUMPER-3-NC_BY_PASTE_YES_SILK_FULL_BOX]
JP10  JUMPER-PAD-3-NC_BY_PASTE  [PAD-JUMPER-3-NC_BY_PASTE_YES_SILK_FULL_BOX]
JP11  JUMPER-PAD-3-NC_BY_PASTE  [PAD-JUMPER-3-NC_BY_PASTE_YES_SILK_FULL_BOX]
K2  DSBT2-M-2D-DC1.5V  [DS-BT]
LED2  GREEN  LED0603  [CHIPLED_0603]
Q2  MOSFET-NCHANNELAO3404A  [SOT23-3]
R50  10k  RESISTOR0402-RES  [0402-RES]
R51  0.001  0.001OHM-3W-1%(2512)3W/1%  [2512]
R52  0  RESISTOR0402-RES  [0402-RES]
R53  125  RESISTOR1206  [1206]
R54  250  RESISTOR0402-RES  [0402-RES]
R55  100k  RESISTOR0402-RES  [0402-RES]
R56  10k  RESISTOR0402-RES  [0402-RES]
R57  250  RESISTOR0402-RES  [0402-RES]
R58  47  RESISTOR0402-RES  [0402-RES]
R59  47  RESISTOR0402-RES  [0402-RES]
R60  10k  RESISTOR0402-RES  [0402-RES]
R61  RESISTOR1206  [1206]
R62  125  RESISTOR0402-RES  [0402-RES]
R63  125  RESISTOR0402-RES  [0402-RES]
R64  10k  RESISTOR0402-RES  [0402-RES]
R68  0  RESISTOR0805-RES  [0805]
R69  10k  RESISTOR0402-RES  [0402-RES]
R70  100k  RESISTOR0402-RES  [0402-RES]
R71  250  RESISTOR0402-RES  [0402-RES]
R72  250  RESISTOR0402-RES  [0402-RES]
TP15  TESTPOINT0.1"  [1X01_ROUND]
TP16  TESTPOINT0.1"  [1X01_ROUND]
TP17  TESTPOINT0.1"  [1X01_ROUND]
TP18  TESTPOINT0.1"  [1X01_ROUND]
U$9  SPTAF1/2-3.5  [SPTAF1/2-3.5]
U$10  SPTAF1/2-3.5  [SPTAF1/2-3.5]
U$12  SPTAF1/2-3.5  [SPTAF1/2-3.5]
U$14  MUX509  [R-PDSO-G16]

### Nets
A0: TP18.1 U$14.P$1(A0) ; also sheet 2,16,18,19,20,21,22,23,24,25,26,27,28,29,30,31
DAC2: R54.1 R70.2 TP17.1 ; also sheet 10
FB2: JP11.3 R69.1
GND: C38.2 C39.2 C40.2 C41.2 C42.2 C43.1 C44.1 C45.1 C46.2 C50.1 C51.1 D26.C D27.C IC6.5(REF) IC7.5(REF) Q2.2(S) R55.1 R60.1 R70.1 U$10.P$1 U$10.P$2 U$14.P$6(S3A) U$14.P$11(S3B) U$14.P$15(GND) ; also sheet 1,2,3,4,5,6,7,8,9,10,11,12,13,15,16,18,19,20,21,22,23,24,25,26,27,28,29,30,31
N$57: D18.A D19.C K2.4(2:P) R51.2 R64.1 R72.1
N$58: K2.13(3:P) R57.2
N$59: IC6.1(RG) R53.1
N$60: IC6.8(RG) R53.2
N$61: C38.1 IC5.3(+IN) R54.2
N$62: D20.A K2.16(1:-) Q2.3(D) R56.1
N$63: LED2.C R56.2
N$64: C47.1 C48.1 IC5.2(-IN) JP11.2 R60.2
N$65: C47.2 C49.2 R50.2 R51.1 R68.2 R71.1 U$9.P$3 U$9.P$4
N$66: IC6.6(OUT) R58.1
N$67: IC7.6(OUT) JP9.3 R59.1 R69.2
N$68: C48.2 C49.1 IC5.6(OUT) R52.1 R68.1
N$69: IC7.1(RG) R61.1
N$70: IC7.8(RG) R61.2
N$71: IC7.2(-IN) JP9.2
N$72: IC7.3(+IN) JP10.2
N$73: D24.C D25.A D27.A JP9.1 R62.2
N$74: R62.1 U$12.P$3 U$12.P$4
N$75: D22.C D23.A D26.A JP10.1 R63.2
N$76: R63.1 U$12.P$1 U$12.P$2
N$77: JP10.3 R64.2
N$83: JP11.1 R50.1 R57.1
N$84: R52.2 U$9.P$1 U$9.P$2
N$85: IC6.2(-IN) U$14.P$8(DA)
N$86: IC6.3(+IN) U$14.P$9(DB)
N$91: C52.2 R72.2 U$14.P$10(S4B)
N$92: C52.1 R71.2 U$14.P$7(S4A)
OUT2: K2.8(2:S) K2.9(3:S) U$10.P$3 U$10.P$4
SENSEI2: C46.1 R58.2 TP15.1 ; also sheet 8
SENSEV2: C45.2 R59.2 TP16.1 ; also sheet 8
SWITCH2: Q2.1(G) R55.2 ; also sheet 6
VCC: C40.1 C42.1 C44.2 C50.2 D18.C D20.C D23.C D25.C IC5.7(V+) IC6.7(V+) IC7.7(V+) K2.1(1:+) LED2.A U$14.P$2(EN) U$14.P$14(V+) U$14.P$16(A1) ; also sheet 1,2,3,7,8,11,13,15,16,18,19,20,21,22,23,24,25,26,27,28,29,30,31
VDD: C39.1 C41.1 C43.2 C51.2 D19.A D22.A D24.A IC5.4(V-) IC6.4(V-) IC7.4(V-) U$14.P$3(V-) ; also sheet 1,3,7,8,15,16,18,19,20,21,22,23,24,25,26,27,28,29,30,31
Unconnected: K2.6(2:O) K2.11(3:O) U$14.P$4(S1A) U$14.P$5(S2A) U$14.P$12(S2B) U$14.P$13(S1B)